# Altium project 4x tmc5160.PrjPcb (part 1 of 2)
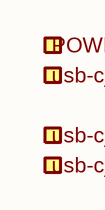
[diagram p0: charge-manager.SchDoc]
10 sheets, 219 parts. Net scope: hierarchical (ports join the sheet entries above them; power ports are global).
Board files: CM5IO.PcbDoc, CM5IO(1).PcbDoc, CM5IO_első terv.PcbDoc
Sheets:
  charge-manager.SchDoc
  CM5IO.SchDoc
    CM5_GPIO ( Ethernet, GPIO, SDCARD) = CM5_GPIO.SchDoc
    CM5_HighSpeed = CM5_HighSpeed.SchDoc
    PCIe-M2 = PCIe-M2.SchDoc
    PSUs = PSUs.SchDoc
    YD-ESP32-S3 = YD-ESP32-S3.SchDoc
      4x tmc5160 = 4x tmc5160.SchDoc
      adc = adc.SchDoc
    USB2-HUB = USB2-HUB.SchDoc

## Sheet charge-manager.SchDoc
size 297 x 209 mm

### Ports
POWER-OUT (in), usb-c_cc1 (in), usb-c_cc (in), usb-c_vbus (in)

### Notes on the sheet
- 1
- 2
- 3
- 4
- 5
- 6
- A
- B
- C
- D
- Title:
- File: charge-manager.kicad_sch
- Sheet: /
- KiCad E.D.A.  kicad (5.1.4)-1
- Size: A4
- Date:
- Rev:
- Id: 1/1

## Sheet CM5IO.SchDoc
size 1188 x 840 mm
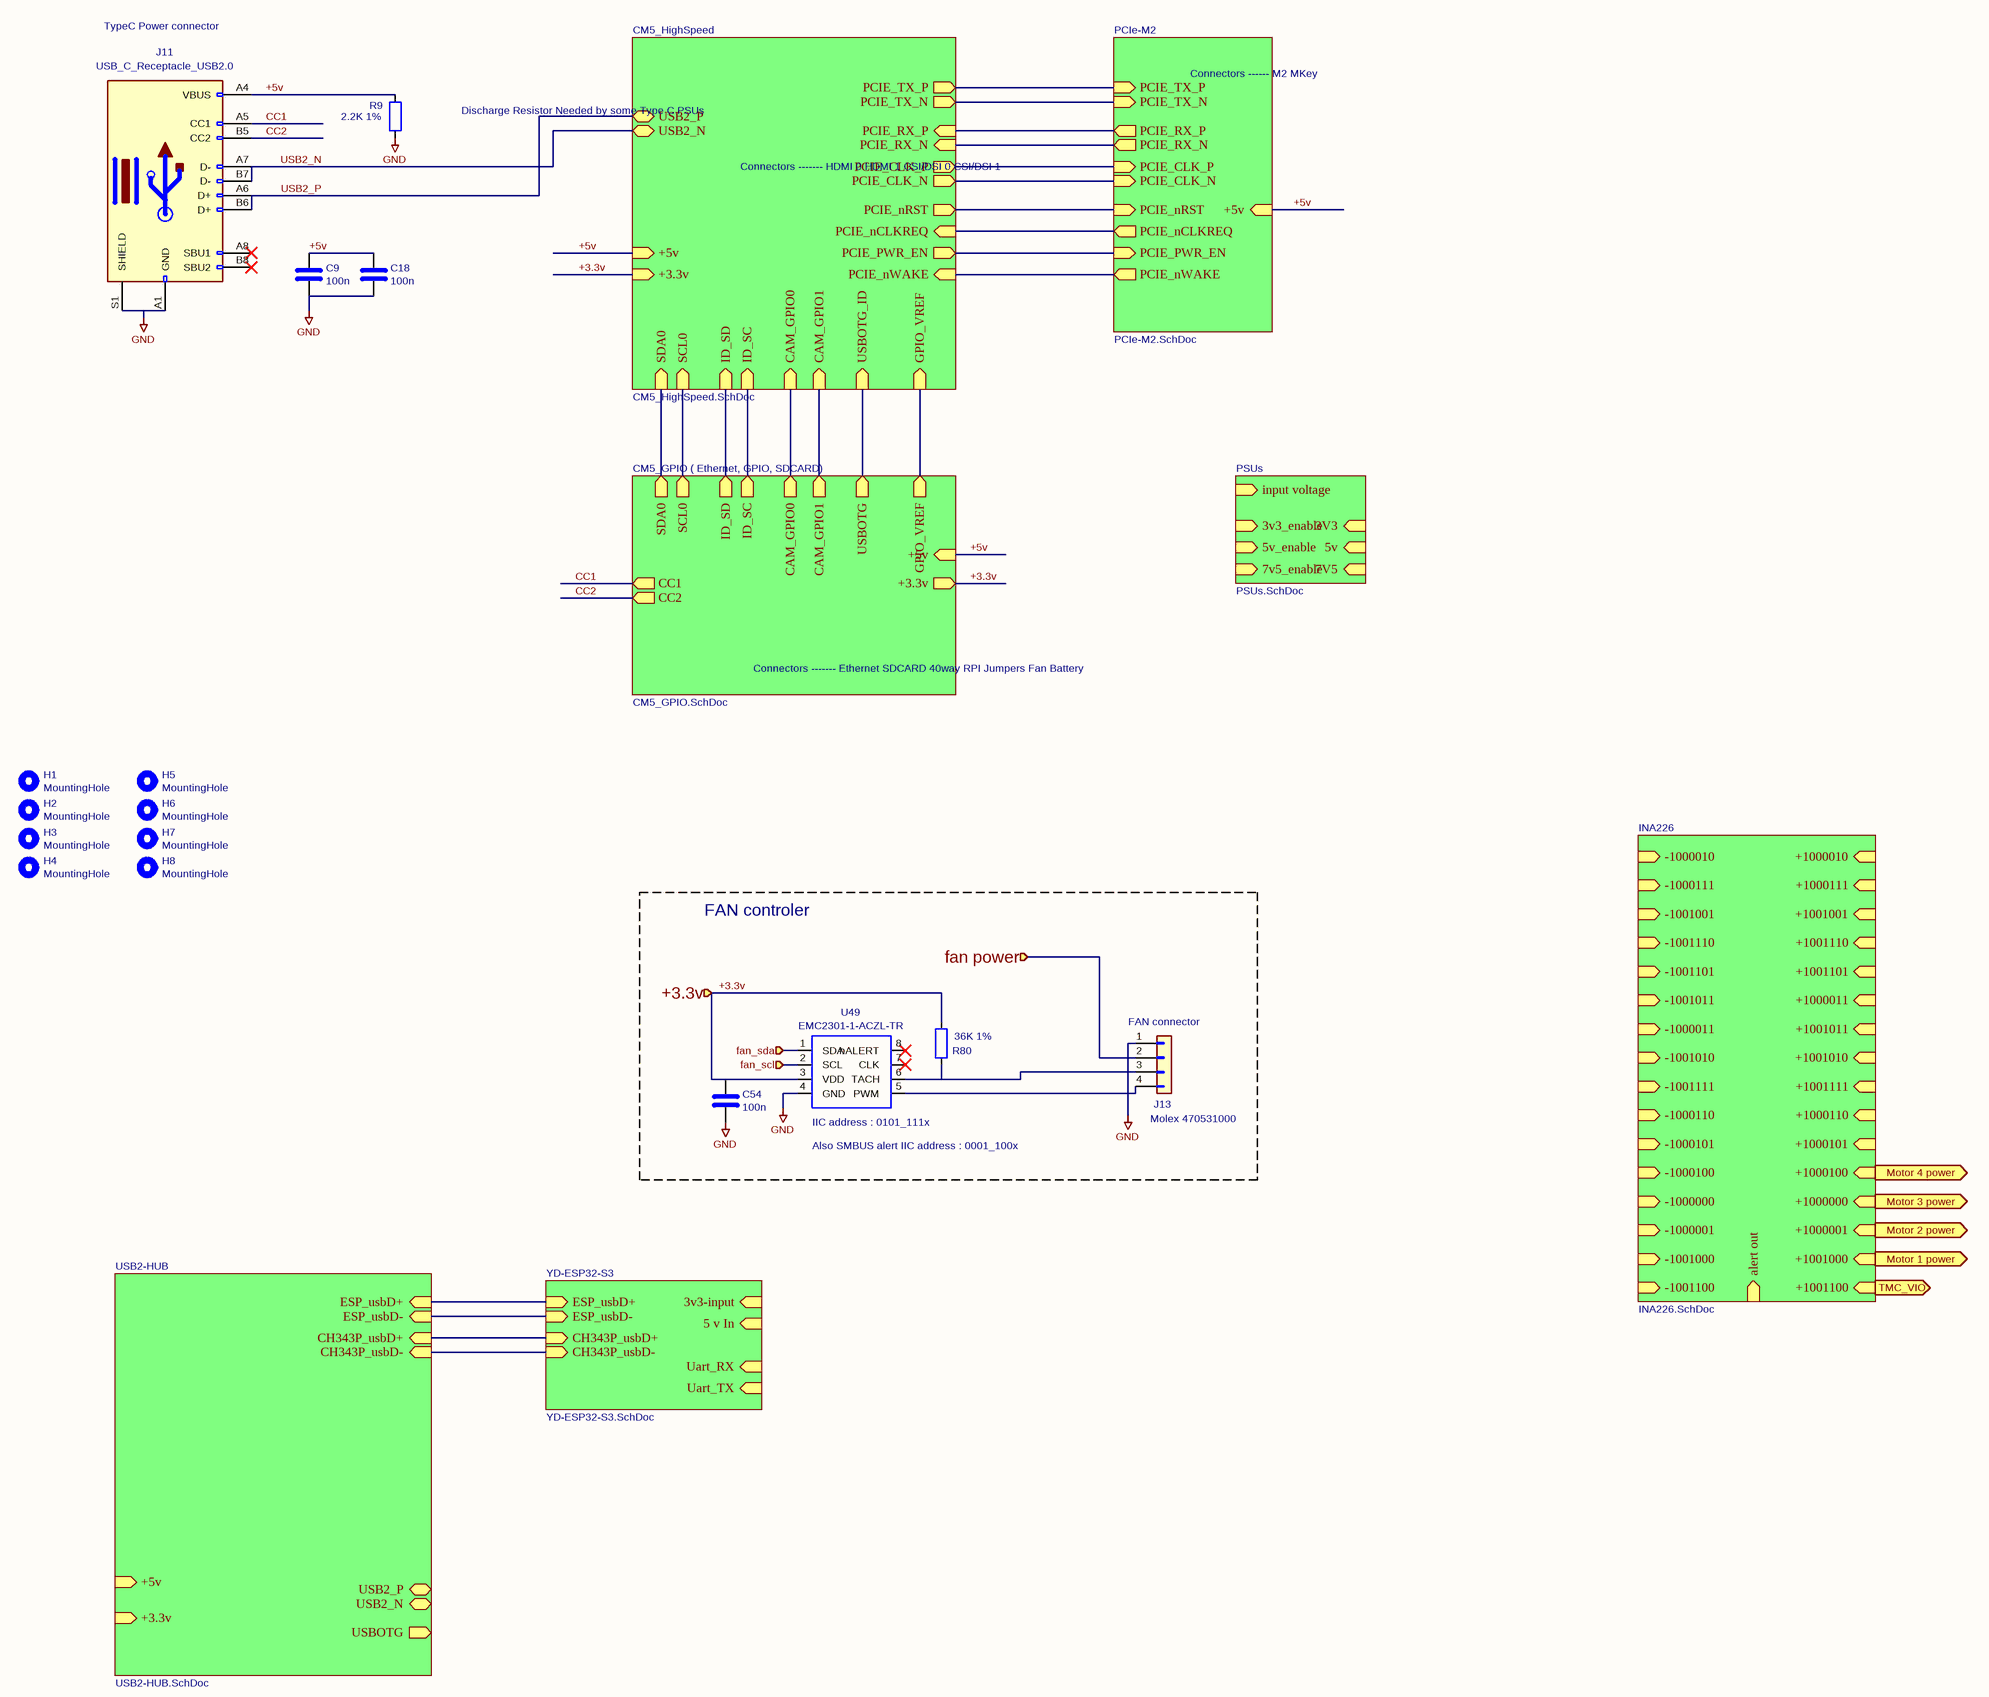
[diagram p1: CM5IO.SchDoc]

### Parts
C9  100n  [C_0402_1005Metric]
C18  100n  [C_0402_1005Metric]
C54  100n  [C_0805_2012Metric]
H1  MountingHole  [MountingHole_2.7mm_M2.5_DIN965]
H2  MountingHole  [MountingHole_2.7mm_M2.5_DIN965]
H3  MountingHole  [MountingHole_2.7mm_M2.5_DIN965]
H4  MountingHole  [MountingHole_2.7mm_M2.5_DIN965]
H5  MountingHole  [MountingHole_2.7mm_M2.5_DIN965]
H6  MountingHole  [MountingHole_2.7mm_M2.5_DIN965]
H7  MountingHole  [MountingHole_2.7mm_M2.5_DIN965]
H8  MountingHole  [MountingHole_2.7mm_M2.5_DIN965]
J11  USB_C_Receptacle_USB2.0  [USB_C_Receptacle_GCT_USB4105-xx-A_16P_TopMnt_Horizontal]
J13  Molex 470531000  [FanPinHeader_1x04_P2.54mm_Vertical]
R9  2.2K 1%  [R_0402_1005Metric]
R80  36K 1%  [R_0805_2012Metric_Pad1.20x1.40mm_HandSolder]
U49  EMC2301-1-ACZL-TR  [MSOP-8_3x3mm_P0.65mm]

### Blocks framed on the sheet
FAN controler: C54 J13 R80 U49

### Sub-sheets
CM5_GPIO ( Ethernet, GPIO, SDCARD) = CM5_GPIO.SchDoc: ID_SC (out), ID_SD (out), SCL0 (out), SDA0 (out), +5v (in), +3.3v (out), GPIO_VREF (out), CAM_GPIO0 (out), CAM_GPIO1 (out), CC1 (out), USBOTG (out), CC2 (out)
CM5_HighSpeed = CM5_HighSpeed.SchDoc: USB2_N (bidir), USB2_P (bidir), ID_SC (in), ID_SD (in), SCL0 (in), SDA0 (in), +5v (in), PCIE_CLK_P (out), PCIE_CLK_N (out), PCIE_TX_P (out), PCIE_TX_N (out), PCIE_nRST (out), PCIE_RX_P (in), PCIE_RX_N (in), PCIE_nCLKREQ (in), +3.3v (in), USBOTG_ID (in), GPIO_VREF (in), PCIE_PWR_EN (out), PCIE_nWAKE (in), CAM_GPIO0 (in), CAM_GPIO1 (in)
INA226 = INA226.SchDoc (file not in this document): -1000000 (in), +1000000 (in), alert out (in), -1000001 (in), +1000001 (in), -1001000 (in), +1001000 (in), -1001100 (in), +1001100 (in), -1000100 (in), +1000100 (in), -1000101 (in), +1000101 (in), -1001010 (in), +1001010 (in), -1001110 (in), -1001101 (in), +1001110 (in), -1001001 (in), +1001001 (in), -1000111 (in), +1000111 (in), -1001011 (in), +1001011 (in), -1001111 (in), +1001111 (in), +1001101 (in), -1000011 (in), +1000011 (in), -1000110 (in), +1000110 (in), -1000010 (in), +1000010 (in)
PCIe-M2 = PCIe-M2.SchDoc: PCIE_CLK_P (in), PCIE_CLK_N (in), PCIE_TX_P (in), PCIE_TX_N (in), PCIE_nCLKREQ (out), PCIE_nRST (in), PCIE_RX_P (out), PCIE_RX_N (out), +5v (in), PCIE_PWR_EN (in), PCIE_nWAKE (out)
PSUs = PSUs.SchDoc: 3v3_enable (in), input voltage (in), 5v (in), 5v_enable (in), 3V3 (in), 7v5_enable (in), 7V5 (in)
USB2-HUB = USB2-HUB.SchDoc: USB2_N (bidir), USB2_P (bidir), +5v (in), +3.3v (in), USBOTG (out), ESP_usbD+ (in), ESP_usbD- (in), CH343P_usbD+ (in), CH343P_usbD- (in)
YD-ESP32-S3 = YD-ESP32-S3.SchDoc: 3v3-input (in), ESP_usbD+ (in), ESP_usbD- (in), 5 v In (in), CH343P_usbD+ (in), CH343P_usbD- (in), Uart_RX (in), Uart_TX (in)

### Ports
+3.3v (in), fan power (in), fan_scl (in), fan_sda (in), Motor 1 power (in), Motor 2 power (in), Motor 3 power (in), Motor 4 power (in), TMC_VIO (in)

### Nets
GND: C9.2 C18.2 C54.2 J11.A1(GND) J11.S1(SHIELD) J13.1(Pin_1) R9.2 U49.4(GND)  [project net DPHY1_C_N]
+3.3v: C54.1 R80.2 U49.3(VDD) ; port +3.3v, sheet CM5_GPIO ( Ethernet, GPIO, SDCARD)/+3.3v, sheet CM5_HighSpeed/+3.3v
+5v: C9.1 C18.1 J11.A4(VBUS) R9.1 ; sheet CM5_GPIO ( Ethernet, GPIO, SDCARD)/+5v, sheet CM5_HighSpeed/+5v, sheet PCIe-M2/+5v
CAM_GPIO0: sheet CM5_GPIO ( Ethernet, GPIO, SDCARD)/CAM_GPIO0, sheet CM5_HighSpeed/CAM_GPIO0
CAM_GPIO1: sheet CM5_GPIO ( Ethernet, GPIO, SDCARD)/CAM_GPIO1, sheet CM5_HighSpeed/CAM_GPIO1
CC1: J11.A5(CC1) ; sheet CM5_GPIO ( Ethernet, GPIO, SDCARD)/CC1
CC2: J11.B5(CC2) ; sheet CM5_GPIO ( Ethernet, GPIO, SDCARD)/CC2
CH343P_usbD+: sheet YD-ESP32-S3/CH343P_usbD+, sheet USB2-HUB/CH343P_usbD+
CH343P_usbD-: sheet YD-ESP32-S3/CH343P_usbD-, sheet USB2-HUB/CH343P_usbD-
ESP_usbD+: sheet YD-ESP32-S3/ESP_usbD+, sheet USB2-HUB/ESP_usbD+
ESP_usbD-: sheet YD-ESP32-S3/ESP_usbD-, sheet USB2-HUB/ESP_usbD-
fan power: J13.2(Pin_2) ; port fan power
fan_scl: U49.2(SCL) ; port fan_scl
fan_sda: U49.1(SDA) ; port fan_sda
GPIO_VREF: sheet CM5_GPIO ( Ethernet, GPIO, SDCARD)/GPIO_VREF, sheet CM5_HighSpeed/GPIO_VREF
ID_SC: sheet CM5_GPIO ( Ethernet, GPIO, SDCARD)/ID_SC, sheet CM5_HighSpeed/ID_SC
ID_SD: sheet CM5_GPIO ( Ethernet, GPIO, SDCARD)/ID_SD, sheet CM5_HighSpeed/ID_SD
Motor 1 power: port Motor 1 power, sheet INA226/+1001000
Motor 2 power: port Motor 2 power, sheet INA226/+1000001
Motor 3 power: port Motor 3 power, sheet INA226/+1000000
Motor 4 power: port Motor 4 power, sheet INA226/+1000100
PCIE_CLK_N: sheet CM5_HighSpeed/PCIE_CLK_N, sheet PCIe-M2/PCIE_CLK_N
PCIE_CLK_P: sheet CM5_HighSpeed/PCIE_CLK_P, sheet PCIe-M2/PCIE_CLK_P
PCIE_nCLKREQ: sheet CM5_HighSpeed/PCIE_nCLKREQ, sheet PCIe-M2/PCIE_nCLKREQ
PCIE_nRST: sheet CM5_HighSpeed/PCIE_nRST, sheet PCIe-M2/PCIE_nRST
PCIE_nWAKE: sheet CM5_HighSpeed/PCIE_nWAKE, sheet PCIe-M2/PCIE_nWAKE
PCIE_PWR_EN: sheet CM5_HighSpeed/PCIE_PWR_EN, sheet PCIe-M2/PCIE_PWR_EN
PCIE_RX_N: sheet CM5_HighSpeed/PCIE_RX_N, sheet PCIe-M2/PCIE_RX_N
PCIE_RX_P: sheet CM5_HighSpeed/PCIE_RX_P, sheet PCIe-M2/PCIE_RX_P
PCIE_TX_N: sheet CM5_HighSpeed/PCIE_TX_N, sheet PCIe-M2/PCIE_TX_N
PCIE_TX_P: sheet CM5_HighSpeed/PCIE_TX_P, sheet PCIe-M2/PCIE_TX_P
SCL0: sheet CM5_GPIO ( Ethernet, GPIO, SDCARD)/SCL0, sheet CM5_HighSpeed/SCL0
SDA0: sheet CM5_GPIO ( Ethernet, GPIO, SDCARD)/SDA0, sheet CM5_HighSpeed/SDA0
TMC_VIO: port TMC_VIO, sheet INA226/+1001100
USB2_N: J11.A7(D-) J11.B7(D-) ; sheet CM5_HighSpeed/USB2_N
USB2_P: J11.A6(D+) J11.B6(D+) ; sheet CM5_HighSpeed/USB2_P
USBOTG: sheet CM5_GPIO ( Ethernet, GPIO, SDCARD)/USBOTG, sheet CM5_HighSpeed/USBOTG_ID
NetJ13_3: J13.3(Pin_3) R80.1 U49.6(TACH)
NetJ13_4: J13.4(Pin_4) U49.5(PWM)

Not connected (* = marked no-connect by the designer): J11 A8(SBU1)* A9(VBUS) A12(GND) B1(GND) B4(VBUS) B8(SBU2)* B9(VBUS) B12(GND); U49 7(CLK)* 8(nALERT)*

### Notes on the sheet
- TypeC Power connector
- Connectors
  ------
  M2 MKey
- Discharge Resistor
  Needed by some
  Type C PSUs
- Connectors
  -------
  HDMI 0
  HDMI 1
  CSI/DSI 0
  CSI/DSI 1
- Connectors
  -------
  Ethernet
  SDCARD
  40way RPI
  Jumpers
  Fan
  Battery
- (near J13) FAN connector
- (near U49) IIC address : 0101_111x
- (near U49) Also SMBUS alert IIC address : 0001_100x
- 1
- 2
- 3
- 4
- 5
- 6
- 7
- 8
- 9
- 10
- 11
- 12
- 13
- 14
- 15
- 16
- 17
- 18
- 19
- 20
- 21
- 22
- 23
- A
- B
- C
- D
- E
- F
- G
- H
- I
- J
- K
- L
- M
- N
- O
- P
- www.raspberrypi.com <http://www.raspberrypi.com>
- Title: Compute Module 5 IO Board - Top Level
- File: CM5IO.kicad_sch
- Sheet: /
- Copyright © 2024 Raspberry Pi Ltd.
- KiCad E.D.A.  kicad (5.1.4)-1
- Size: A0
- Date:
- Rev: 1
- Id: 1/1

### Library data of the parts
C9 C18 = C: Part Description: 0.1uF 10% 16V Ceramic Capacitor X7R 0402 (1005 Metric); Field4: Farnell; Field5: 2611911; Field6: RM EMK105 B7104KV-F; Field7: TAIYO YUDEN EUROPE GMBH; Field8: 110091611; Value: 100n; Footprint: Capacitor_SMD:C_0402_1005Metric
C54 = C: Part Description: 0.1uF 10% 16V Ceramic Capacitor X7R 0402 (1005 Metric); Description: Unpolarized capacitor; Field4: Farnell; Field5: 2611911; Field6: RM EMK105 B7104KV-F; Field7: TAIYO YUDEN EUROPE GMBH; Field8: 110091611; Value: 100n; Footprint: Capacitor_SMD:C_0805_2012Metric
H1-H8 = MountingHole: Part Description: M2.5 mounting hole; Field4: nf; Field5: nf; Field6: nf; Field7: nf; Value: MountingHole; Footprint: CM5IO:MountingHole_2.7mm_M2.5_DIN965
J11 = USB_C_Receptacle_USB2.0_16P: Part Description: USBC USB2 data and power connector; Field5: USBF31-0171; Field7: MTCONN; Field6: USBF31-0171; Value: USB_C_Receptacle_USB2.0; Footprint: Connector_USB:USB_C_Receptacle_GCT_USB4105-xx-A_16P_TopMnt_Horizontal
J13 = Conn_01x04: Part Description: Connector Header Through Hole 4 position 0.100" (2.54mm); Description: Generic connector, single row, 01x04, script generated (kicad-library-utils/schlib/autogen/connector/); Field4: Farnell; Field5: 2313705; Field6: 470531000; Field7: Molex; Value: Molex 470531000; Footprint: Connector:FanPinHeader_1x04_P2.54mm_Vertical
R9 = R: Part Description: Resistor 2.2K M1005 1% 63mW; Field4: Farnell; Value: 2.2K 1%; Footprint: Resistor_SMD:R_0402_1005Metric
R80 = R: Part Description: Resistor 36K M1005 1% 63mW; Description: Resistor; Field4: Farnell; Field5: 1458788; Field7: Rohm; Field6: MCR01MZPF3602; Value: 36K 1%; Footprint: Resistor_SMD:R_0805_2012Metric_Pad1.20x1.40mm_HandSolder
U49 = EMC2301: Part Description: Motor Driver PWM 8-MSOP; Field4: Digikey; Field5: EMC2301-1-ACZL-CT-ND; Field7: Microchip; Field6: EMC2301-1-ACZL-TR; Value: EMC2301-1-ACZL-TR; Footprint: Package_SO:MSOP-8_3x3mm_P0.65mm

## Sheet CM5_GPIO.SchDoc
size 297 x 209 mm
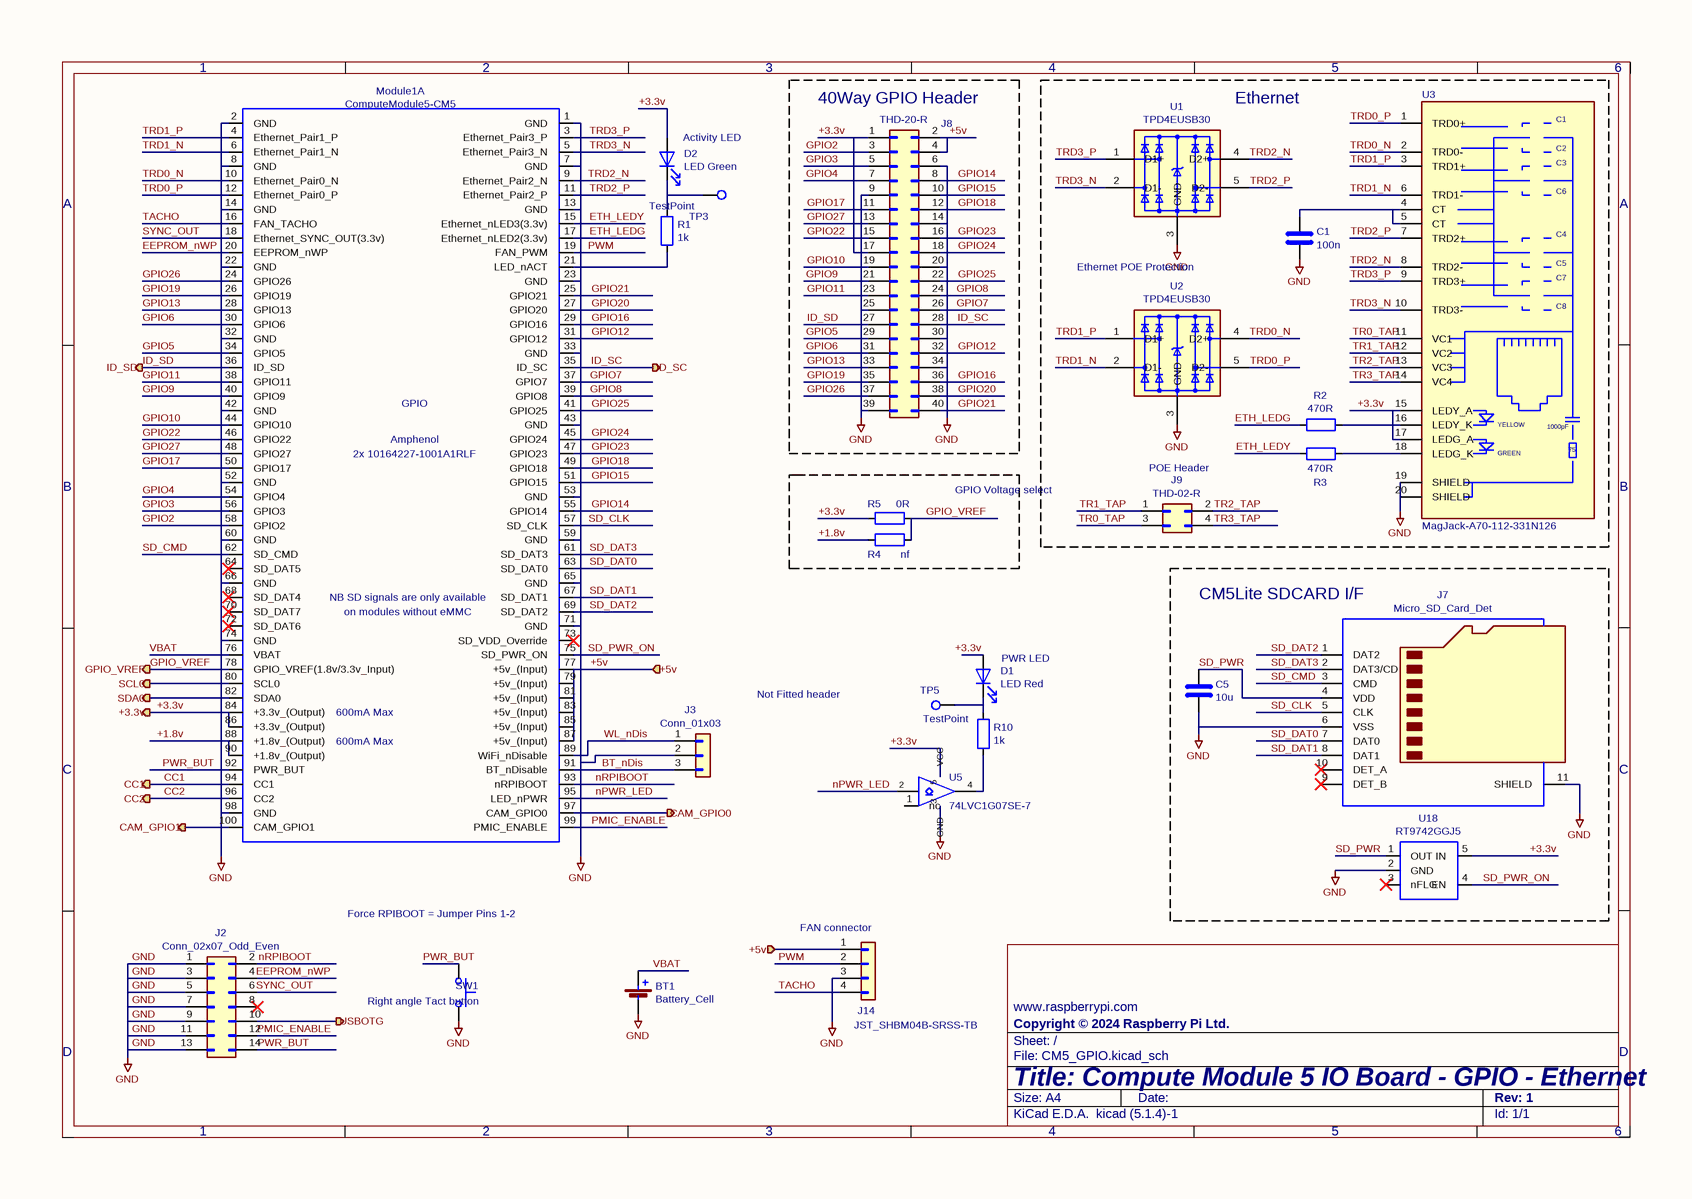
[diagram p2: CM5_GPIO.SchDoc]

### Parts
BT1  Battery_Cell  [BatteryHolder_Keystone_3034_1x20mm]
C1  100n  [C_0402_1005Metric]
C5  10u  [C_0805_2012Metric]
D1  LED Red  [LED_0603_1608Metric]
D2  LED Green  [LED_0603_1608Metric]
J2  Conn_02x07_Odd_Even  [PinHeader_2x07_P2.54mm_Vertical]
J3  Conn_01x03  [PinHeader_1x03_P2.54mm_Vertical]
J7  Micro_SD_Card_Det  [SDCARD_MOLEX_503398-1892]
J8  THD-20-R  [PinHeader_2x20_P2.54mm_Vertical]
J9  THD-02-R  [PinHeader_2x02_P2.54mm_Vertical]
J14  JST_SHBM04B-SRSS-TB  [JST_SH_BM04B-SRSS-TB_1x04-1MP_P1.00mm_Vertical]
Module1  Field4: Amphenol  Field5: 2x 10164227-1001A1RLF  [Raspberry-Pi-5-Compute-Module]  (hidden comment: ComputeModule5-CM5)  (part A of 2)
R1  1k  [R_0402_1005Metric]
R2  470R  [R_0402_1005Metric]
R3  470R  [R_0402_1005Metric]
R4  nf  [R_0805_2012Metric_Pad1.20x1.40mm_HandSolder]
R5  0R  [R_0805_2012Metric_Pad1.20x1.40mm_HandSolder]
R10  1k  [R_0402_1005Metric]
SW1  Right angle Tact button  [SW_Tactile_SPST_Angled_PTS645Vx58-2LFS]
TP3  TestPoint  [TestPoint_Pad_2.0x2.0mm]
TP5  TestPoint  [TestPoint_Pad_2.0x2.0mm]
U1  TPD4EUSB30  [USON-10_2.5x1.0mm_P0.5mm]
U2  TPD4EUSB30  [USON-10_2.5x1.0mm_P0.5mm]
U3  MagJack-A70-112-331N126  [TRJG0926HENL]
U5  74LVC1G07SE-7  [SOT-353_SC-70-5]
U18  RT9742GGJ5  [SOT-23-5]

### Blocks framed on the sheet
40Way GPIO Header: J8
Ethernet: C1 J9 R2 R3 U1-U3
GPIO Voltage select /: R4 R5
CM5Lite SDCARD I/F: C5 J7 U18

### Ports
+3.3v (out), +5v (in), CAM_GPIO0 (out), CAM_GPIO1 (out), CC1 (out), CC2 (out), GPIO_VREF (out), ID_SC (out), ID_SD (out), SCL0 (out), SDA0 (out), USBOTG (out)

### Nets
GND: BT1.2(-) C1.2 C5.2 J2.1(Pin_1) J2.3(Pin_3) J2.5(Pin_5) J2.7(Pin_7) J2.9(Pin_9) J2.11(Pin_11) J2.13(Pin_13) J3.2(Pin_2) J7.6(VSS) J7.11(SHIELD) J8.6(Pin_6) J8.9(Pin_9) J8.14(Pin_14) J8.20(Pin_20) J8.25(Pin_25) J8.30(Pin_30) J8.34(Pin_34) J8.39(Pin_39) J14.3(Pin_3) Module1.1(GND) Module1.2(GND) Module1.7(GND) Module1.8(GND) Module1.13(GND) Module1.14(GND) Module1.22(GND) Module1.23(GND) Module1.32(GND) Module1.33(GND) Module1.42(GND) Module1.43(GND) Module1.52(GND) Module1.53(GND) Module1.59(GND) Module1.60(GND) Module1.65(GND) Module1.66(GND) Module1.71(GND) Module1.74(GND) Module1.98(GND) SW1.2 U1.3(GND) U2.3(GND) U3.19(SHIELD) U3.20(SHIELD) U5.3(GND) U18.2(GND)  [project net DPHY1_C_N]
+1.8v: Module1.88(+1.8v_(Output)) Module1.90(+1.8v_(Output)) R4.1
+3.3v: D1.2(A) D2.2(A) J8.1(Pin_1) J8.17(Pin_17) Module1.84(+3.3v_(Output)) Module1.86(+3.3v_(Output)) R5.1 U3.15(LEDY_A) U3.17(LEDG_A) U5.5(VCC) U18.5(IN) ; port +3.3v
+5v: J8.2(Pin_2) J8.4(Pin_4) J14.1(Pin_1) Module1.77(+5v_(Input)) Module1.79(+5v_(Input)) Module1.81(+5v_(Input)) Module1.83(+5v_(Input)) Module1.85(+5v_(Input)) Module1.87(+5v_(Input)) ; port +5v
BT_nDis: J3.3(Pin_3) Module1.91(BT_nDisable)
CAM_GPIO0: Module1.97(CAM_GPIO0) ; port CAM_GPIO0
CAM_GPIO1: Module1.100(CAM_GPIO1) ; port CAM_GPIO1
CC1: Module1.94(CC1) ; port CC1
CC2: Module1.96(CC2) ; port CC2
EEPROM_nWP: J2.4(Pin_4) Module1.20(EEPROM_nWP)
ETH_LEDG: Module1.17(Ethernet_nLED2(3.3v)) R2.2
ETH_LEDY: Module1.15(Ethernet_nLED3(3.3v)) R3.2
GPIO2: J8.3(Pin_3) Module1.58(GPIO2)
GPIO3: J8.5(Pin_5) Module1.56(GPIO3)
GPIO4: J8.7(Pin_7) Module1.54(GPIO4)
GPIO5: J8.29(Pin_29) Module1.34(GPIO5)
GPIO6: J8.31(Pin_31) Module1.30(GPIO6)
GPIO7: J8.26(Pin_26) Module1.37(GPIO7)
GPIO8: J8.24(Pin_24) Module1.39(GPIO8)
GPIO9: J8.21(Pin_21) Module1.40(GPIO9)
GPIO10: J8.19(Pin_19) Module1.44(GPIO10)
GPIO11: J8.23(Pin_23) Module1.38(GPIO11)
GPIO12: J8.32(Pin_32) Module1.31(GPIO12)
GPIO13: J8.33(Pin_33) Module1.28(GPIO13)
GPIO14: J8.8(Pin_8) Module1.55(GPIO14)
GPIO15: J8.10(Pin_10) Module1.51(GPIO15)
GPIO16: J8.36(Pin_36) Module1.29(GPIO16)
GPIO17: J8.11(Pin_11) Module1.50(GPIO17)
GPIO18: J8.12(Pin_12) Module1.49(GPIO18)
GPIO19: J8.35(Pin_35) Module1.26(GPIO19)
GPIO20: J8.38(Pin_38) Module1.27(GPIO20)
GPIO21: J8.40(Pin_40) Module1.25(GPIO21)
GPIO22: J8.15(Pin_15) Module1.46(GPIO22)
GPIO23: J8.16(Pin_16) Module1.47(GPIO23)
GPIO24: J8.18(Pin_18) Module1.45(GPIO24)
GPIO25: J8.22(Pin_22) Module1.41(GPIO25)
GPIO26: J8.37(Pin_37) Module1.24(GPIO26)
GPIO27: J8.13(Pin_13) Module1.48(GPIO27)
GPIO_VREF: Module1.78(GPIO_VREF(1.8v/3.3v_Input)) R4.2 R5.2 ; port GPIO_VREF
ID_SC: J8.28(Pin_28) Module1.35(ID_SC) ; port ID_SC
ID_SD: J8.27(Pin_27) Module1.36(ID_SD) ; port ID_SD
nPWR_LED: Module1.95(LED_nPWR) U5.2
nRPIBOOT: J2.2(Pin_2) Module1.93(nRPIBOOT)
PMIC_ENABLE: J2.12(Pin_12) Module1.99(PMIC_ENABLE)
PWM: J14.2(Pin_2) Module1.19(FAN_PWM)
PWR_BUT: J2.14(Pin_14) Module1.92(PWR_BUT) SW1.1
SCL0: Module1.80(SCL0) ; port SCL0
SD_CLK: J7.5(CLK) Module1.57(SD_CLK)
SD_CMD: J7.3(CMD) Module1.62(SD_CMD)
SD_DAT0: J7.7(DAT0) Module1.63(SD_DAT0)
SD_DAT1: J7.8(DAT1) Module1.67(SD_DAT1)
SD_DAT2: J7.1(DAT2) Module1.69(SD_DAT2)
SD_DAT3: J7.2(DAT3/CD) Module1.61(SD_DAT3)
SD_PWR: C5.1 J7.4(VDD) U18.1(OUT)
SD_PWR_ON: Module1.75(SD_PWR_ON) U18.4(EN)
SDA0: Module1.82(SDA0) ; port SDA0
SYNC_OUT: J2.6(Pin_6) Module1.18(Ethernet_SYNC_OUT(3.3v))
TACHO: J14.4(Pin_4) Module1.16(FAN_TACHO)
TR0_TAP: J9.3(Pin_3) U3.11(VC1)
TR1_TAP: J9.1(Pin_1) U3.12(VC2)
TR2_TAP: J9.2(Pin_2) U3.13(VC3)
TR3_TAP: J9.4(Pin_4) U3.14(VC4)
TRD0_N: Module1.10(Ethernet_Pair0_N) U2.4(D2+) U3.2(TRD0-)
TRD0_P: Module1.12(Ethernet_Pair0_P) U2.5(D2-) U3.1(TRD0+)
TRD1_N: Module1.6(Ethernet_Pair1_N) U2.2(D1-) U3.6(TRD1-)
TRD1_P: Module1.4(Ethernet_Pair1_P) U2.1(D1+) U3.3(TRD1+)
TRD2_N: Module1.9(Ethernet_Pair2_N) U1.4(D2+) U3.8(TRD2-)
TRD2_P: Module1.11(Ethernet_Pair2_P) U1.5(D2-) U3.7(TRD2+)
TRD3_N: Module1.5(Ethernet_Pair3_N) U1.2(D1-) U3.10(TRD3-)
TRD3_P: Module1.3(Ethernet_Pair3_P) U1.1(D1+) U3.9(TRD3+)
USBOTG: J2.10(Pin_10) ; port USBOTG
VBAT: BT1.1(+) Module1.76(VBAT)
WL_nDis: J3.1(Pin_1) Module1.89(WiFi_nDisable)
NetC1_1: C1.1 U3.4(CT) U3.5(CT)
NetD1_1: D1.1(K) R10.1 TP5.1
NetD2_1: D2.1(K) R1.1 TP3.1
NetModule1_21: Module1.21(LED_nACT) R1.2
NetR2_1: R2.1 U3.16(LEDY_K)
NetR3_1: R3.1 U3.18(LEDG_K)
NetR10_2: R10.2 U5.4

Not connected (* = marked no-connect by the designer): J2 8(Pin_8)*; J7 9(DET_B)* 10(DET_A)*; Module1 64(SD_DAT5)* 68(SD_DAT4)* 70(SD_DAT7)* 72(SD_DAT6)* 73(SD_VDD_Override)*; U1 6 7 8(GND) 9 10; U2 6 7 8(GND) 9 10; U5 1(nc); U18 3(nFLG)*

### Notes on the sheet
- (near D2) Activity LED
- Ethernet POE
  Protection
- (near J9) POE Header
- Not Fitted header
- (near D1) PWR LED
- Force RPIBOOT = Jumper Pins 1-2
- (near J14) FAN connector
- 1
- 2
- 3
- 4
- 5
- 6
- A
- B
- C
- www.raspberrypi.com <http://www.raspberrypi.com>
- D
- Title: Compute Module 5 IO Board - GPIO - Ethernet
- File: CM5_GPIO.kicad_sch
- Sheet: /
- Copyright © 2024 Raspberry Pi Ltd.
- KiCad E.D.A.  kicad (5.1.4)-1
- Size: A4
- Date:
- Rev: 1
- Id: 1/1
- (in symbol ComputeModule5-CM5, part A) GPIO; NB SD signals are only available; on modules without eMMC; 600mA Max
- (in symbol MagJack-A70-112-331N126) C1; C2; C3; C6; C4; C5; C7; C8; YELLOW; 1000pF; 75; GREEN

### Library data of the parts
BT1 = Battery_Cell: Part Description: Battery Retainer Coin, 20.0mm 1 Cell SMD (SMT) Tab; Field4: Digikey; Field5: 36-3034-ND; Field6: 3034; Field7: Keystone; Value: Battery_Cell; Footprint: CM5IO:BatteryHolder_Keystone_3034_1x20mm
C1 = C: as C9 on sheet CM5IO; Value: 100n; Footprint: Capacitor_SMD:C_0402_1005Metric
C5 = C: Part Description: 10uF 10% 10V Ceramic Capacitor X7R 0805 (2012 Metric); Field5: 490-14381-1-ND; Field4: Digikey; Field6: GRM21BR71A106KA73L; Field7: Murata; Field8: 111893011; Value: 10u; Footprint: Capacitor_SMD:C_0805_2012Metric
D1 = LED_1: Part Description: Red 620nm LED Indication - Discrete 2.2V 2-SMD, No Lead; Field4: Digikey; Field5: LTST-S270KRKT; Field6: SML-A12U8TT86Q; Field7: Rohm; Field8: 650295101; Value: LED Red; Footprint: LED_SMD:LED_0603_1608Metric
D2 = LED: Part Description: Green 572nm LED Indication - Discrete 2.2V 2-SMD, No Lead; Field4: Digikey; Field5: LTST-S270KGKT; Field6: SML-A12M8TT86N; Field7: Rohm; Field8: 650263301; Value: LED Green; Footprint: LED_SMD:LED_0603_1608Metric
J2 = Conn_02x07_Odd_Even: Field4: Toby; Field5: THD-07-R; Field6: THD-07-R; Field7: Toby; Part Description: PinHeader_2x07_P2.54mm_Vertical; Value: Conn_02x07_Odd_Even; Footprint: Connector_PinHeader_2.54mm:PinHeader_2x07_P2.54mm_Vertical
J3 = Conn_01x03: Part Description: 3pin 0.1" connector; Field4: nf; Field5: nf; Field6: nf; Field7: nf; Value: Conn_01x03; Footprint: Connector_PinHeader_2.54mm:PinHeader_1x03_P2.54mm_Vertical
J7 = Micro_SD_Card_Det2: Part Description: 9 (8 + 1) Position Card Connector microSD™ Surface Mount, Right Angle Gold; Field4: Farnell; Field5: 2358234; Field6: 503398-1892; Field7: Molex; Field8: UCON00512; Value: Micro_SD_Card_Det; Footprint: CM5IO:SDCARD_MOLEX_503398-1892
J8 = Conn_02x20_Odd_Even: Field4: Toby; Field8: UCON00511; Field5: THD-20-R; Field6: THD-20-R; Field7: Toby; Part Description: PinHeader_2x20_P2.54mm_Vertical; Value: THD-20-R; Footprint: Connector_PinHeader_2.54mm:PinHeader_2x20_P2.54mm_Vertical
J9 = Conn_02x02_Odd_Even: Field4: Toby; Field6: 151-604-425-761; Field7: EDAC; Field8: UCON00791; Field5: THD-02-R; Part Description: PinHeader_2x02_P2.54mm_Vertical; Value: THD-02-R; Footprint: Connector_PinHeader_2.54mm:PinHeader_2x02_P2.54mm_Vertical
J14 = Conn_01x04: Part Description: 4 pin vertical 1mm pitch connector; Field7: JST; Field5: SHBM04B-SRSS-TB; Field6: SHBM04B-SRSS-TB; Value: JST_SHBM04B-SRSS-TB; Footprint: Connector_JST:JST_SH_BM04B-SRSS-TB_1x04-1MP_P1.00mm_Vertical
Module1 = ComputeModule5-CM5: Part Description: 100 Position Connector Receptacle, Center Strip Contacts Surface Mount Gold; Description: RaspberryPi Compute module 5; Field7: Hirose; Field6: 2x 10164227-1001A1RLF; Value: ComputeModule5-CM5; Footprint: CM5IO:Raspberry-Pi-5-Compute-Module
R1 R10 = R: Part Description: Resistor 1K M1005 1% 63mW; Field4: Farnell; Field5: 9239235; Field7: KOA EUROPE GMBH; Field6: RK73H1ETTP1001F; Field8: 125049511; Value: 1k; Footprint: Resistor_SMD:R_0402_1005Metric
R2 R3 = R: Part Description: Resistor 470R M1005 1% 63mW; Field4: Farnell; Field5: 9239197; Field7: KOA EUROPE GMBH; Field6: RK73G1ETQTP4700D; Field8: 120887981; Value: 470R; Footprint: Resistor_SMD:R_0402_1005Metric
R4 = R: Field4: nf; Field5: nf; Field6: nf; Value: nf; Footprint: Resistor_SMD:R_0805_2012Metric_Pad1.20x1.40mm_HandSolder
R5 = R: Part Description: Resistor 0R M2012 5%; Field4: Farnell; Field5: 9233750; Field7: Rohm; Field6: MCR10EZPJ000; Field8: 121629591; Value: 0R; Footprint: Resistor_SMD:R_0805_2012Metric_Pad1.20x1.40mm_HandSolder
SW1 = SW_Push: Part Description: Right angle through hole Tact switch; Description: Push button switch, generic, two pins; Field5: PTS645VH58-2LFS; Field7: CK; Field6: PTS645VH58-2LFS; Value: Right angle Tact button; Footprint: Button_Switch_THT:SW_Tactile_SPST_Angled_PTS645Vx58-2LFS
TP3 TP5 = TestPoint: Field4: nf; Field5: nf; Field6: nf; Field7: nf; Part Description: Test point; Value: TestPoint; Footprint: TestPoint:TestPoint_Pad_2.0x2.0mm
U1 U2 = TPD4EUSB30: Part Description: Quad TVS diode for high speed signals (USB3, GigE etc.); Field4: Farnell; Field5: 2335455; Field6: CDDFN10-3324P-13; Field7: Bourns; Field8: UDIO00346; Value: TPD4EUSB30; Footprint: Package_SON:USON-10_2.5x1.0mm_P0.5mm
U3 = MagJack-A70-112-331N126: Part Description: Gigabit Ethernet Magjack; Field7: Trxcon; Field8: UCON00900; Field6: TRJG0926HENL; Field5: TRJG0926HENL; Value: MagJack-A70-112-331N126; Footprint: CM5IO:TRJG0926HENL
U5 = 74LVC1G07_copy: Part Description: Buffer, Non-Inverting 1 Element 1 Bit per Element Open Drain Output SOT-353; Field4: Farnell; Field5: 2425492; Field7: Diodes; Field6: 74LVC1G07SE-7; Value: 74LVC1G07SE-7; Footprint: Package_TO_SOT_SMD:SOT-353_SC-70-5
U18 = RT9742GGJ5: Part Description: Power Switch/Driver 1:1 N-Channel 1A TSOT-23-5; Field4: Farnell; Field5: 2545875; Field7: RichTek; Field8: USWI00166; Field6: RT9742GGJ5; Value: RT9742GGJ5; Footprint: Package_TO_SOT_SMD:SOT-23-5

## Sheet CM5_HighSpeed.SchDoc
size 297 x 209 mm
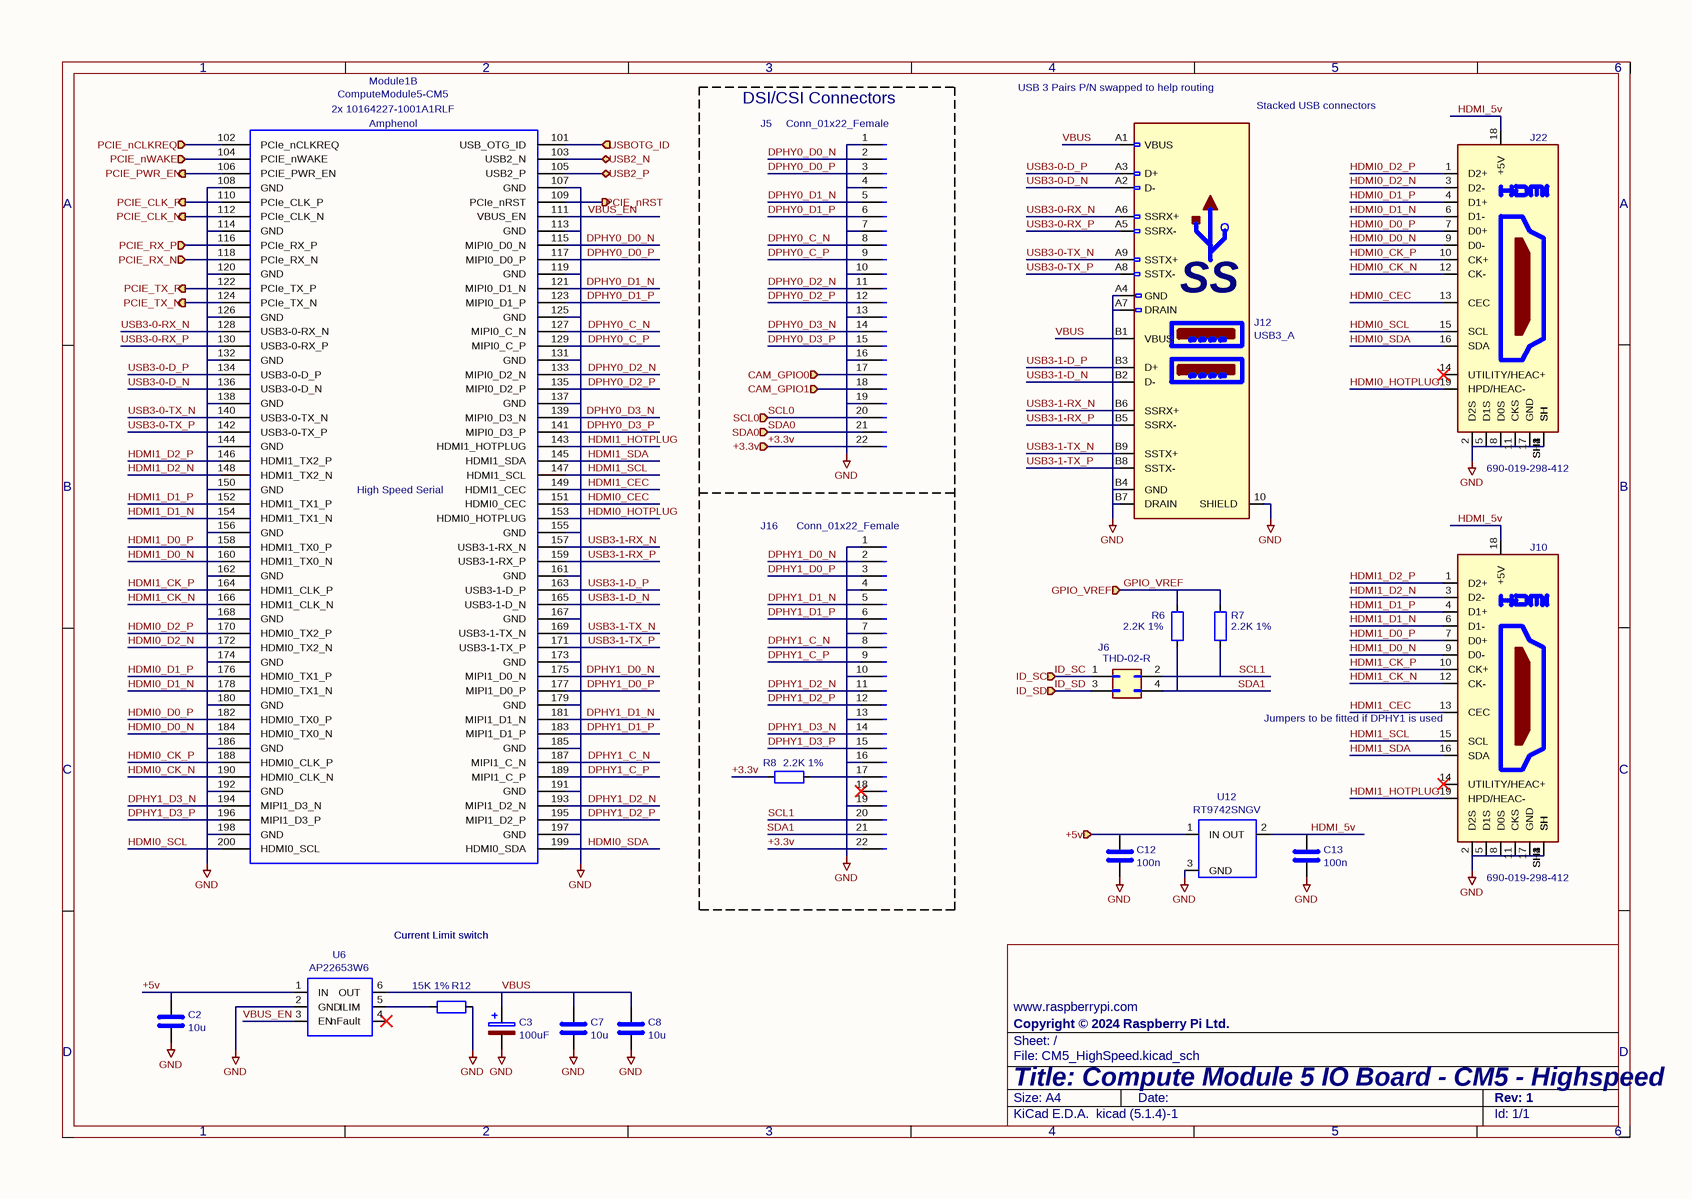
[diagram p3: CM5_HighSpeed.SchDoc]

### Parts
C2  10u  [C_0805_2012Metric]
C3  100uF  [CP_EIA-7343-31_Kemet-D]
C7  10u  [C_0805_2012Metric]
C8  10u  [C_0805_2012Metric]
C12  100n  [C_0402_1005Metric]
C13  100n  [C_0402_1005Metric]
J5  Conn_01x22_Female  [Hirose_FH12-22S-0.5SH_1x22-1MP_P0.50mm_Horizontal]
J6  THD-02-R  [PinHeader_2x02_P2.54mm_Vertical]
J10  690-019-298-412  [EDAC 690-019-298-412]
J12  USB3_A  [MTCONN_UBAF30-D2011]
J16  Conn_01x22_Female  [Hirose_FH12-22S-0.5SH_1x22-1MP_P0.50mm_Horizontal]
J22  690-019-298-412  [EDAC 690-019-298-412]
Module1  Field4: Amphenol  Field5: 2x 10164227-1001A1RLF  [Raspberry-Pi-5-Compute-Module]  (hidden comment: ComputeModule5-CM5)  (part B of 2)
R6  2.2K 1%  [R_0402_1005Metric]
R7  2.2K 1%  [R_0402_1005Metric]
R8  2.2K 1%  [R_0402_1005Metric]
R12  15K 1%  [R_0402_1005Metric]
U6  AP22653W6  [SOT-23-6]
U12  RT9742SNGV  [TSOT-23_HandSoldering]

### Ports
+3.3v (in), +5v (in), CAM_GPIO0 (in), CAM_GPIO1 (in), GPIO_VREF (in), ID_SC (in), ID_SD (in), PCIE_CLK_N (out), PCIE_CLK_P (out), PCIE_nCLKREQ (in), PCIE_nRST (out), PCIE_nWAKE (in), PCIE_PWR_EN (out), PCIE_RX_N (in), PCIE_RX_P (in), PCIE_TX_N (out), PCIE_TX_P (out), SCL0 (in), SDA0 (in), USB2_N (bidir), USB2_P (bidir), USBOTG_ID (in)

### Nets
DPHY1_C_N: C2.2 C3.2 C7.2 C8.2 C12.2 C13.2 J5.1(Pin_1) J5.4(Pin_4) J5.7(Pin_7) J5.10(Pin_10) J5.13(Pin_13) J5.16(Pin_16) J5.19(Pin_19) J10.2(D2S) J10.5(D1S) J10.8(D0S) J10.11(CKS) J10.17(GND) J10.SH1(SH) J10.SH2(SH) J10.SH3(SH) J10.SH4(SH) J12.10(SHIELD) J12.A4(GND) J12.A7(DRAIN) J12.B4(GND) J12.B7(DRAIN) J16.1(Pin_1) J16.4(Pin_4) J16.7(Pin_7) J16.8(Pin_8) J16.10(Pin_10) J16.13(Pin_13) J16.16(Pin_16) J16.19(Pin_19) J22.2(D2S) J22.5(D1S) J22.8(D0S) J22.11(CKS) J22.17(GND) J22.SH1(SH) J22.SH2(SH) J22.SH3(SH) J22.SH4(SH) Module1.107(GND) Module1.108(GND) Module1.113(GND) Module1.114(GND) Module1.119(GND) Module1.120(GND) Module1.125(GND) Module1.126(GND) Module1.131(GND) Module1.132(GND) Module1.137(GND) Module1.138(GND) Module1.144(GND) Module1.150(GND) Module1.155(GND) Module1.156(GND) Module1.161(GND) Module1.162(GND) Module1.167(GND) Module1.168(GND) Module1.173(GND) Module1.174(GND) Module1.179(GND) Module1.180(GND) Module1.185(GND) Module1.186(GND) Module1.187(MIPI1_C_N) Module1.191(GND) Module1.192(GND) Module1.197(GND) Module1.198(GND) R12.2 U6.2(GND) U12.3(GND)  [also labelled GND]
+3.3v: J5.22(Pin_22) J16.22(Pin_22) R8.1 ; port +3.3v
+5v: C12.1 U12.1(IN) ; port +5v
+5v: C2.1 U6.1(IN)  [a separate net that carries the same name]
CAM_GPIO0: J5.17(Pin_17) ; port CAM_GPIO0
CAM_GPIO1: J5.18(Pin_18) ; port CAM_GPIO1
DPHY0_C_N: J5.8(Pin_8) Module1.127(MIPI0_C_N)
DPHY0_C_P: J5.9(Pin_9) Module1.129(MIPI0_C_P)
DPHY0_D0_N: J5.2(Pin_2) Module1.115(MIPI0_D0_N)
DPHY0_D0_P: J5.3(Pin_3) Module1.117(MIPI0_D0_P)
DPHY0_D1_N: J5.5(Pin_5) Module1.121(MIPI0_D1_N)
DPHY0_D1_P: J5.6(Pin_6) Module1.123(MIPI0_D1_P)
DPHY0_D2_N: J5.11(Pin_11) Module1.133(MIPI0_D2_N)
DPHY0_D2_P: J5.12(Pin_12) Module1.135(MIPI0_D2_P)
DPHY0_D3_N: J5.14(Pin_14) Module1.139(MIPI0_D3_N)
DPHY0_D3_P: J5.15(Pin_15) Module1.141(MIPI0_D3_P)
DPHY1_C_P: J16.9(Pin_9) Module1.189(MIPI1_C_P)
DPHY1_D0_N: J16.2(Pin_2) Module1.175(MIPI1_D0_N)
DPHY1_D0_P: J16.3(Pin_3) Module1.177(MIPI1_D0_P)
DPHY1_D1_N: J16.5(Pin_5) Module1.181(MIPI1_D1_N)
DPHY1_D1_P: J16.6(Pin_6) Module1.183(MIPI1_D1_P)
DPHY1_D2_N: J16.11(Pin_11) Module1.193(MIPI1_D2_N)
DPHY1_D2_P: J16.12(Pin_12) Module1.195(MIPI1_D2_P)
DPHY1_D3_N: J16.14(Pin_14) Module1.194(MIPI1_D3_N)
DPHY1_D3_P: J16.15(Pin_15) Module1.196(MIPI1_D3_P)
GPIO_VREF: R6.1 R7.1 ; port GPIO_VREF
HDMI0_CEC: J22.13(CEC) Module1.151(HDMI0_CEC)
HDMI0_CK_N: J22.12(CK-) Module1.190(HDMI0_CLK_N)
HDMI0_CK_P: J22.10(CK+) Module1.188(HDMI0_CLK_P)
HDMI0_D0_N: J22.9(D0-) Module1.184(HDMI0_TX0_N)
HDMI0_D0_P: J22.7(D0+) Module1.182(HDMI0_TX0_P)
HDMI0_D1_N: J22.6(D1-) Module1.178(HDMI0_TX1_N)
HDMI0_D1_P: J22.4(D1+) Module1.176(HDMI0_TX1_P)
HDMI0_D2_N: J22.3(D2-) Module1.172(HDMI0_TX2_N)
HDMI0_D2_P: J22.1(D2+) Module1.170(HDMI0_TX2_P)
HDMI0_HOTPLUG: J22.19(HPD/HEAC-) Module1.153(HDMI0_HOTPLUG)
HDMI0_SCL: J22.15(SCL) Module1.200(HDMI0_SCL)
HDMI0_SDA: J22.16(SDA) Module1.199(HDMI0_SDA)
HDMI1_CEC: J10.13(CEC) Module1.149(HDMI1_CEC)
HDMI1_CK_N: J10.12(CK-) Module1.166(HDMI1_CLK_N)
HDMI1_CK_P: J10.10(CK+) Module1.164(HDMI1_CLK_P)
HDMI1_D0_N: J10.9(D0-) Module1.160(HDMI1_TX0_N)
HDMI1_D0_P: J10.7(D0+) Module1.158(HDMI1_TX0_P)
HDMI1_D1_N: J10.6(D1-) Module1.154(HDMI1_TX1_N)
HDMI1_D1_P: J10.4(D1+) Module1.152(HDMI1_TX1_P)
HDMI1_D2_N: J10.3(D2-) Module1.148(HDMI1_TX2_N)
HDMI1_D2_P: J10.1(D2+) Module1.146(HDMI1_TX2_P)
HDMI1_HOTPLUG: J10.19(HPD/HEAC-) Module1.143(HDMI1_HOTPLUG)
HDMI1_SCL: J10.15(SCL) Module1.147(HDMI1_SCL)
HDMI1_SDA: J10.16(SDA) Module1.145(HDMI1_SDA)
HDMI_5v: C13.1 J10.18(+5V) J22.18(+5V) U12.2(OUT)
ID_SC: J6.1(Pin_1) ; port ID_SC
ID_SD: J6.3(Pin_3) ; port ID_SD
PCIE_CLK_N: Module1.112(PCIe_CLK_N) ; port PCIE_CLK_N
PCIE_CLK_P: Module1.110(PCIe_CLK_P) ; port PCIE_CLK_P
PCIE_nCLKREQ: Module1.102(PCIe_nCLKREQ) ; port PCIE_nCLKREQ
PCIE_nRST: Module1.109(PCIe_nRST) ; port PCIE_nRST
PCIE_nWAKE: Module1.104(PCIE_nWAKE) ; port PCIE_nWAKE
PCIE_PWR_EN: Module1.106(PCIE_PWR_EN) ; port PCIE_PWR_EN
PCIE_RX_N: Module1.118(PCIe_RX_N) ; port PCIE_RX_N
PCIE_RX_P: Module1.116(PCIe_RX_P) ; port PCIE_RX_P
PCIE_TX_N: Module1.124(PCIe_TX_N) ; port PCIE_TX_N
PCIE_TX_P: Module1.122(PCIe_TX_P) ; port PCIE_TX_P
SCL0: J5.20(Pin_20) ; port SCL0
SCL1: J6.2(Pin_2) J16.20(Pin_20) R7.2
SDA0: J5.21(Pin_21) ; port SDA0
SDA1: J6.4(Pin_4) J16.21(Pin_21) R6.2
USB2_N: Module1.103(USB2_N) ; port USB2_N
USB2_P: Module1.105(USB2_P) ; port USB2_P
USB3-0-D_N: J12.A2(D-) Module1.136(USB3-0-D_N)
USB3-0-D_P: J12.A3(D+) Module1.134(USB3-0-D_P)
USB3-0-RX_N: J12.A6(SSRX+) Module1.128(USB3-0-RX_N)
USB3-0-RX_P: J12.A5(SSRX-) Module1.130(USB3-0-RX_P)
USB3-0-TX_N: J12.A9(SSTX+) Module1.140(USB3-0-TX_N)
USB3-0-TX_P: J12.A8(SSTX-) Module1.142(USB3-0-TX_P)
USB3-1-D_N: J12.B2(D-) Module1.165(USB3-1-D_N)
USB3-1-D_P: J12.B3(D+) Module1.163(USB3-1-D_P)
USB3-1-RX_N: J12.B6(SSRX+) Module1.157(USB3-1-RX_N)
USB3-1-RX_P: J12.B5(SSRX-) Module1.159(USB3-1-RX_P)
USB3-1-TX_N: J12.B9(SSTX+) Module1.169(USB3-1-TX_N)
USB3-1-TX_P: J12.B8(SSTX-) Module1.171(USB3-1-TX_P)
USBOTG: Module1.101(USB_OTG_ID) ; port USBOTG_ID
VBUS: C3.1 C7.1 C8.1 J12.A1(VBUS) J12.B1(VBUS) U6.6(OUT)
VBUS_EN: Module1.111(VBUS_EN) U6.3(EN)
NetJ16_17: J16.17(Pin_17) R8.2
NetR12_1: R12.1 U6.5(ILIM)

Not connected (* = marked no-connect by the designer): J10 14(UTILITY/HEAC+)*; J16 18(Pin_18)*; J22 14(UTILITY/HEAC+)*; U6 4(nFault)*

### Notes on the sheet
- (near J5) DSI/CSI Connectors
- (near J12) USB 3 Pairs P/N swapped to help routing
- (near J12) Stacked USB connectors
- (near J10) Jumpers to be fitted if DPHY1 is used
- Current Limit switch
- 1
- 2
- 3
- 4
- 5
- 6
- A
- B
- C
- www.raspberrypi.com <http://www.raspberrypi.com>
- D
- Title: Compute Module 5 IO Board - CM5 - Highspeed
- File: CM5_HighSpeed.kicad_sch
- Sheet: /
- Copyright © 2024 Raspberry Pi Ltd.
- KiCad E.D.A.  kicad (5.1.4)-1
- Size: A4
- Date:
- Rev: 1
- Id: 1/1
- (in symbol ComputeModule5-CM5, part B) High Speed Serial
- (in symbol USB3_A) SS

### Library data of the parts
C2 C7 C8 = C: as C5 on sheet CM5_GPIO; Value: 10u; Footprint: Capacitor_SMD:C_0805_2012Metric
C3 = C_Polarized: Part Description: Capacitor, SP-Cap, 100u, 6.3V, 15mR ESR; Field4: Mouser; Field5: 667-EEF-CX0J101R; Field7: Panasonic; Value: 100uF; Footprint: Capacitor_Tantalum_SMD:CP_EIA-7343-31_Kemet-D
C12 C13 = C: as C9 on sheet CM5IO; Value: 100n; Footprint: Capacitor_SMD:C_0402_1005Metric
J5 J16 = Conn_01x22_Socket: Part Description: 22 Position FFC, FPC Connector Contacts, Bottom 0.020" (0.50mm) Surface Mount, Right Angle; Field4: Mouser; Field5: 798-FH12-22S-0.5SH55; Field6: FH12-22S-0.5SH55; Field7: Hirose; Value: Conn_01x22_Female; Footprint: CM5IO:Hirose_FH12-22S-0.5SH_1x22-1MP_P0.50mm_Horizontal
J6 = Conn_02x02_Odd_Even: as J9 on sheet CM5_GPIO; Field5: THD-02-R; Part Description: PinHeader_2x02_P2.54mm_Vertical; Value: THD-02-R; Footprint: Connector_PinHeader_2.54mm:PinHeader_2x02_P2.54mm_Vertical
J10 J22 = HDMI_A_1.4: Part Description: HDMI Connector, Right Angle, 19 Contacts, Receptacle, Surface Mount, Surface Mount Right Angle; Field4: Farnell; Field5: 2614936; Field7: EDAC; Field8: UCON00802; Field6: 690-019-298-412; Value: 690-019-298-412; Footprint: CM5IO:EDAC 690-019-298-412
J12 = USB3_A: Part Description: Dual USB 3 connector; Field6: UBAF30-D2011; Field7: Mtconn; Field5: UBAF30-D2011; Value: USB3_A; Footprint: CM5IO:MTCONN_UBAF30-D2011
Module1 = ComputeModule5-CM5: as Module1 on sheet CM5_GPIO; Field6: 2x 10164227-1001A1RLF; Value: ComputeModule5-CM5; Footprint: CM5IO:Raspberry-Pi-5-Compute-Module
R6-R8 = R: as R9 on sheet CM5IO; Value: 2.2K 1%; Footprint: Resistor_SMD:R_0402_1005Metric
R12 = R: Part Description: Resistor 15K M1005 1% 63mW; Field4: Farnell; Field5: 9239375; Field6: MCR01MZPF1502; Field7: Rohm; Field8: 120891581; Value: 15K 1%; Footprint: Resistor_SMD:R_0402_1005Metric
U6 = AP2553W6: Part Description: Power Switch/Driver 1:1 P-Channel 2.1A SOT-23-6; Field4: Digikey; Field5: 31-AP22653W6-7CT-ND; Field7: Diodes; Field6: AP22653W6; Value: AP22653W6; Footprint: Package_TO_SOT_SMD:SOT-23-6
U12 = RT9742SNGV: Part Description: Power Switch/Driver 1:1 N-Channel 500mA SOT-23-3; Field4: Farnell; Field5: 2575555; Field7: RichTek; Field8: USWI00155; Field6: RT9742SNGV; Value: RT9742SNGV; Footprint: Package_TO_SOT_SMD:TSOT-23_HandSoldering

## Sheet PCIe-M2.SchDoc
size 297 x 209 mm
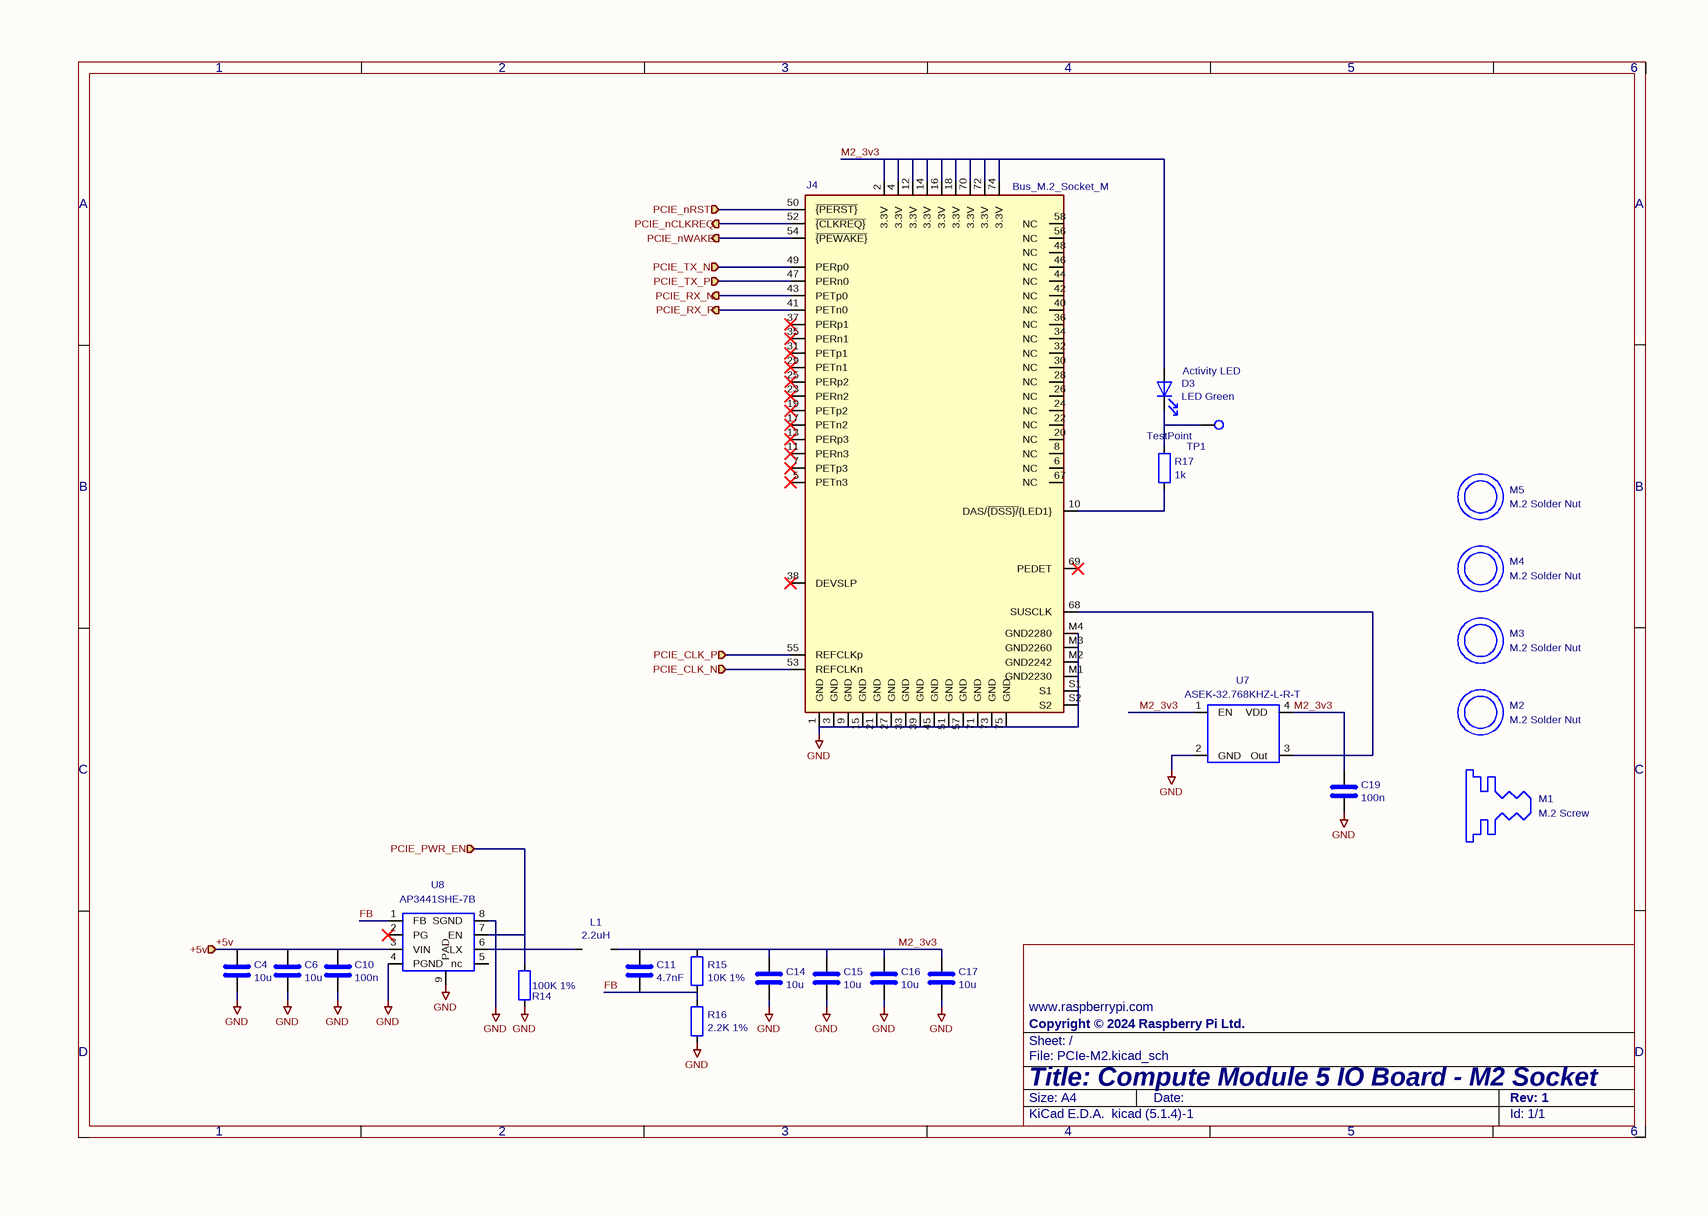
[diagram p4: PCIe-M2.SchDoc]

### Parts
C4  10u  [C_0805_2012Metric]
C6  10u  [C_0805_2012Metric]
C10  100n  [C_0402_1005Metric]
C11  4.7nF  [C_0402_1005Metric]
C14  10u  [C_0805_2012Metric]
C15  10u  [C_0805_2012Metric]
C16  10u  [C_0805_2012Metric]
C17  10u  [C_0805_2012Metric]
C19  100n  [C_0402_1005Metric]
D3  LED Green  [LED_0603_1608Metric]
J4  Bus_M.2_Socket_M  [M.2 M Key socket]
L1  2.2uH  [L_Bourns_SRP5030CC]
M1  M.2 Screw
M2  M.2 Solder Nut
M3  M.2 Solder Nut
M4  M.2 Solder Nut
M5  M.2 Solder Nut
R14  100K 1%  [R_0402_1005Metric]
R15  10K 1%  [R_0402_1005Metric]
R16  2.2K 1%  [R_0402_1005Metric]
R17  1k  [R_0402_1005Metric]
TP1  TestPoint  [TestPoint_Pad_2.0x2.0mm]
U7  ASEK-32.768KHZ-L-R-T  [Crystal_SMD_3225-4Pin_3.2x2.5mm]
U8  AP3441SHE-7B  [DFN-8-1EP_2x2mm_P0.5mm_EP1.05x1.75mm]

### Ports
+5v (in), PCIE_CLK_N (in), PCIE_CLK_P (in), PCIE_nCLKREQ (out), PCIE_nRST (in), PCIE_nWAKE (out), PCIE_PWR_EN (in), PCIE_RX_N (out), PCIE_RX_P (out), PCIE_TX_N (in), PCIE_TX_P (in)

### Nets
GND: C4.2 C6.2 C10.2 C14.2 C15.2 C16.2 C17.2 C19.2 J4.1(GND) J4.3(GND) J4.9(GND) J4.15(GND) J4.21(GND) J4.27(GND) J4.33(GND) J4.39(GND) J4.45(GND) J4.51(GND) J4.57(GND) J4.71(GND) J4.73(GND) J4.75(GND) J4.M1(GND2230) J4.M2(GND2242) J4.M3(GND2260) J4.M4(GND2280) J4.S1 J4.S2 R14.2 R16.2 U7.2(GND) U8.4(PGND) U8.8(SGND) U8.9(PAD)  [project net DPHY1_C_N]
+5v: C4.1 C6.1 C10.1 U8.3(VIN) ; port +5v
FB: C11.2 R15.2 R16.1 U8.1(FB)
M2_3v3: C11.1 C14.1 C15.1 C16.1 C17.1 C19.1 D3.2(A) J4.2(3.3V) J4.4(3.3V) J4.12(3.3V) J4.14(3.3V) J4.16(3.3V) J4.18(3.3V) J4.70(3.3V) J4.72(3.3V) J4.74(3.3V) L1.2 R15.1 U7.1(EN) U7.4(VDD)
PCIE_CLK_N: J4.53(REFCLKn) ; port PCIE_CLK_N
PCIE_CLK_P: J4.55(REFCLKp) ; port PCIE_CLK_P
PCIE_nCLKREQ: J4.52(~{{CLKREQ}}) ; port PCIE_nCLKREQ
PCIE_nRST: J4.50(~{{PERST}}) ; port PCIE_nRST
PCIE_nWAKE: J4.54(~{{PEWAKE}}) ; port PCIE_nWAKE
PCIE_PWR_EN: R14.1 U8.7(EN) ; port PCIE_PWR_EN
PCIE_RX_N: J4.43(PETp0) ; port PCIE_RX_N
PCIE_RX_P: J4.41(PETn0) ; port PCIE_RX_P
PCIE_TX_N: J4.49(PERp0) ; port PCIE_TX_N
PCIE_TX_P: J4.47(PERn0) ; port PCIE_TX_P
NetD3_1: D3.1(K) R17.1 TP1.1
NetJ4_10: J4.10(DAS/~{{DSS}/}{LED1}) R17.2
NetJ4_68: J4.68(SUSCLK) U7.3(Out)
NetL1_1: L1.1 U8.6(LX)

Not connected (* = marked no-connect by the designer): J4 5(PETn3)* 6(NC) 7(PETp3)* 8(NC) 11(PERn3)* 13(PERp3)* 17(PETn2)* 19(PETp2)* 20(NC) 22(NC) 23(PERn2)* 24(NC) 25(PERp2)* 26(NC) 28(NC) 29(PETn1)* 30(NC) 31(PETp1)* 32(NC) 34(NC) 35(PERn1)* 36(NC) 37(PERp1)* 38(DEVSLP)* 40(NC) 42(NC) 44(NC) 46(NC) 48(NC) 56(NC) 58(NC) 67(NC) 69(PEDET)*; U8 2(PG)* 5(nc)

### Notes on the sheet
- (near D3) Activity LED
- 1
- 2
- 3
- 4
- 5
- 6
- A
- B
- C
- www.raspberrypi.com <http://www.raspberrypi.com>
- D
- Title: Compute Module 5 IO Board - M2 Socket
- File: PCIe-M2.kicad_sch
- Sheet: /
- Copyright © 2024 Raspberry Pi Ltd.
- KiCad E.D.A.  kicad (5.1.4)-1
- Size: A4
- Date:
- Rev: 1
- Id: 1/1

### Library data of the parts
C4 C6 C14-C17 = C: Part Description: 10uF 10% 10V Ceramic Capacitor X7R 0805 (2012 Metric); Field4: Digikey; Field5: 490-14381-1-ND; Field6: GRM21BR71A106KA73L; Field7: Murata; Field8: 111893011; Value: 10u; Footprint: Capacitor_SMD:C_0805_2012Metric
C10 C19 = C: as C9 on sheet CM5IO; Value: 100n; Footprint: Capacitor_SMD:C_0402_1005Metric
C11 = C: Part Description: 4.7nF capacitor 0402; Value: 4.7nF; Footprint: Capacitor_SMD:C_0402_1005Metric
D3 = LED: as D2 on sheet CM5_GPIO; Value: LED Green; Footprint: LED_SMD:LED_0603_1608Metric
J4 = Bus_M.2_Socket_M: Part Description: M.2 M Key connector; Description: M.2 Socket 3 Mechanical Key M; Field5: MTSSD03-67MSW337; Field7: MTCONN; Field6: MTSSD03-67MSW337; Value: Bus_M.2_Socket_M; Footprint: CM5IO:M.2 M Key socket
L1 = L: Part Description: Inductor, SMT, 2520, 2u2, IRMS=7A, ISAT=8A, DCR=0.032R; Field6: SRP5030CC-2R2M; Field7: Bourns; Field5: SRP5030CC-2R2M; Value: 2.2uH; Footprint: CM5IO:L_Bourns_SRP5030CC
M1 = M.2_Screw: Part Description: M.2 Screw; Value: M.2 Screw
M2-M5 = SolderNut: Part Description: Solder nut for M.2 slot; Value: M.2 Solder Nut
R14 = R: Part Description: Resistor 100K M1005 1% 63mW; Field4: Farnell; Field6: MCR01MZPF1003; Field7: Rohm; Value: 100K 1%; Footprint: Resistor_SMD:R_0402_1005Metric
R15 = R: Part Description: Resistor 10K M1005 1% 63mW; Field4: Farnell; Field7: Rohm; Field6: MCR01MZPF1002; Value: 10K 1%; Footprint: Resistor_SMD:R_0402_1005Metric
R16 = R: as R9 on sheet CM5IO; Value: 2.2K 1%; Footprint: Resistor_SMD:R_0402_1005Metric
R17 = R: as R1 on sheet CM5_GPIO; Value: 1k; Footprint: Resistor_SMD:R_0402_1005Metric
TP1 = TestPoint: Field4: nf; Field5: nf; Field6: nf; Field7: nf; Part Description: Test point; Value: TestPoint; Footprint: TestPoint:TestPoint_Pad_2.0x2.0mm
U7 = ASEK-32.768KHZ-L-R-T: Part Description: 32KHz Xtal oscilator; Field7: abracon; Field5: ASEK-32.768KHZ-L-R-T; Field6: ASEK-32.768KHZ-L-R-T; Value: ASEK-32.768KHZ-L-R-T; Footprint: Crystal:Crystal_SMD_3225-4Pin_3.2x2.5mm
U8 = AP3441SHE-7B: Part Description: 3A DC-DC converter; Field7: Diodes; Field5: AP3441SHE-7B; Field6: AP3441SHE-7B; Value: AP3441SHE-7B; Footprint: Package_DFN_QFN:DFN-8-1EP_2x2mm_P0.5mm_EP1.05x1.75mm

## Sheet PSUs.SchDoc
size 297 x 209 mm
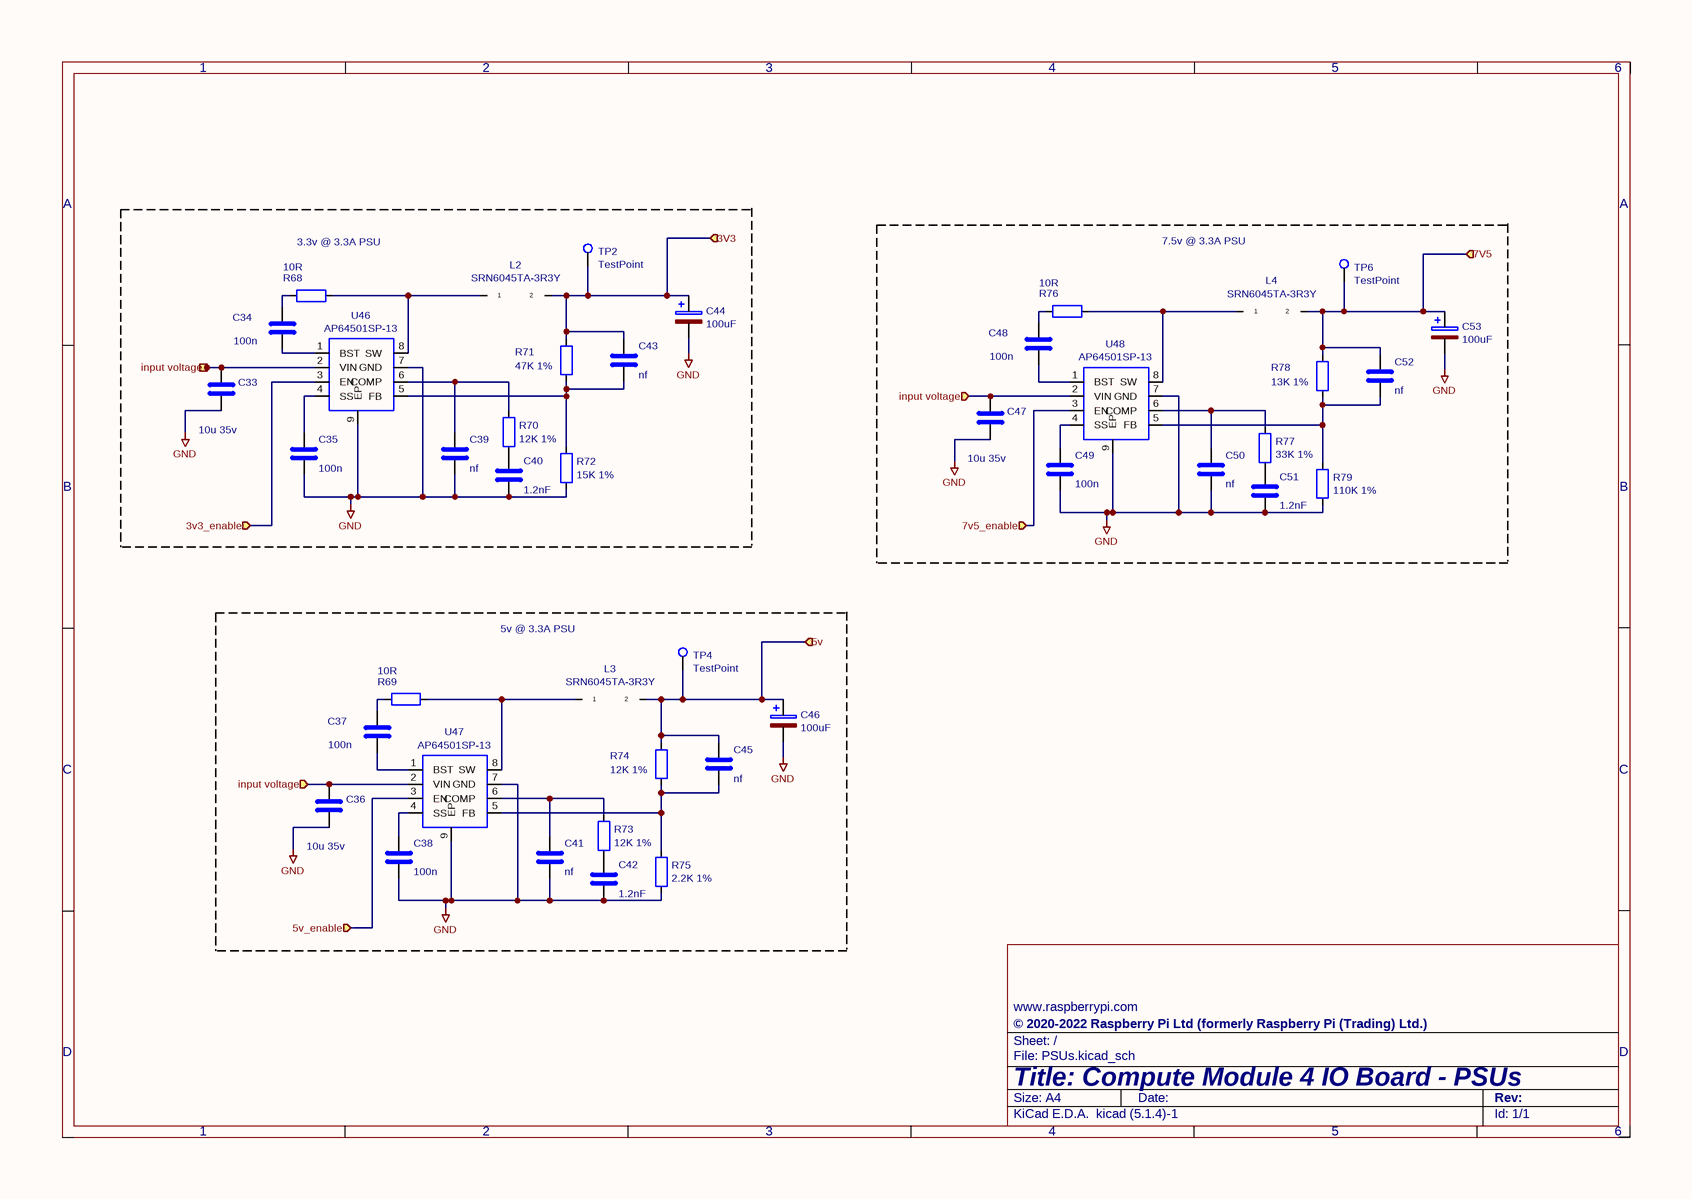
[diagram p5: PSUs.SchDoc]

### Parts
C33  10u 35v  [C_0805_2012Metric]
C34  100n  [C_0805_2012Metric]
C35  100n  [C_0805_2012Metric]
C36  10u 35v  [C_0805_2012Metric]
C37  100n  [C_0805_2012Metric]
C38  100n  [C_0805_2012Metric]
C39  nf  [C_0805_2012Metric]
C40  1.2nF  [C_0805_2012Metric]
C41  nf  [C_0805_2012Metric]
C42  1.2nF  [C_0805_2012Metric]
C43  nf  [C_0805_2012Metric]
C44  100uF  [CP_EIA-7343-31_Kemet-D]
C45  nf  [C_0805_2012Metric]
C46  100uF  [CP_EIA-7343-31_Kemet-D]
C47  10u 35v  [C_0805_2012Metric]
C48  100n  [C_0805_2012Metric]
C49  100n  [C_0805_2012Metric]
C50  nf  [C_0805_2012Metric]
C51  1.2nF  [C_0805_2012Metric]
C52  nf  [C_0805_2012Metric]
C53  100uF  [CP_EIA-7343-31_Kemet-D]
L2  SRN6045TA-3R3Y  [L_Bourns_SRN6045TA]
L3  SRN6045TA-3R3Y  [L_Bourns_SRN6045TA]
L4  SRN6045TA-3R3Y  [L_Bourns_SRN6045TA]
R68  10R  [R_0805_2012Metric_Pad1.20x1.40mm_HandSolder]
R69  10R  [R_0805_2012Metric_Pad1.20x1.40mm_HandSolder]
R70  12K 1%  [R_0805_2012Metric_Pad1.20x1.40mm_HandSolder]
R71  47K 1%  [R_0805_2012Metric_Pad1.20x1.40mm_HandSolder]
R72  15K 1%  [R_0805_2012Metric_Pad1.20x1.40mm_HandSolder]
R73  12K 1%  [R_0805_2012Metric_Pad1.20x1.40mm_HandSolder]
R74  12K 1%  [R_0805_2012Metric_Pad1.20x1.40mm_HandSolder]
R75  2.2K 1%  [R_0805_2012Metric_Pad1.20x1.40mm_HandSolder]
R76  10R  [R_0805_2012Metric_Pad1.20x1.40mm_HandSolder]
R77  33K 1%  [R_0805_2012Metric_Pad1.20x1.40mm_HandSolder]
R78  13K 1%  [R_0805_2012Metric_Pad1.20x1.40mm_HandSolder]
R79  110K 1%  [R_0805_2012Metric_Pad1.20x1.40mm_HandSolder]
TP2  TestPoint  [TestPoint_Pad_1.0x1.0mm]
TP4  TestPoint  [TestPoint_Pad_1.0x1.0mm]
TP6  TestPoint  [TestPoint_Pad_1.0x1.0mm]
U46  AP64501SP-13  [SOIC-8-1EP_3.9x4.9mm_P1.27mm_EP2.95x4.9mm_Mask2.71x3.4mm_ThermalVias]
U47  AP64501SP-13  [SOIC-8-1EP_3.9x4.9mm_P1.27mm_EP2.95x4.9mm_Mask2.71x3.4mm_ThermalVias]
U48  AP64501SP-13  [SOIC-8-1EP_3.9x4.9mm_P1.27mm_EP2.95x4.9mm_Mask2.71x3.4mm_ThermalVias]

### Ports
3V3 (in), 3v3_enable (in), 5v (in), 5v_enable (in), 7V5 (in), 7v5_enable (in), input voltage (in)

### Nets
GND: C33.2 C35.2 C36.2 C38.2 C39.2 C40.2 C41.2 C42.2 C44.2 C46.2 C47.2 C49.2 C50.2 C51.2 C53.2 R72.2 R75.2 R79.2 U46.7(GND) U46.9(EP) U47.7(GND) U47.9(EP) U48.7(GND) U48.9(EP)  [project net DPHY1_C_N]
3V3: C43.1 C44.1 L2.2 R71.1 TP2.1 ; port 3V3
3v3_enable: U46.3(EN) ; port 3v3_enable
5v: C45.1 C46.1 L3.2 R74.1 TP4.1 ; port 5v
5v_enable: U47.3(EN) ; port 5v_enable
7V5: C52.1 C53.1 L4.2 R78.1 TP6.1 ; port 7V5
7v5_enable: U48.3(EN) ; port 7v5_enable
input voltage: C33.1 C36.1 C47.1 U46.2(VIN) U47.2(VIN) U48.2(VIN) ; port input voltage
NetC34_1: C34.1 R68.2
NetC34_2: C34.2 U46.1(BST)
NetC35_1: C35.1 U46.4(SS)
NetC37_1: C37.1 R69.2
NetC37_2: C37.2 U47.1(BST)
NetC38_1: C38.1 U47.4(SS)
NetC39_1: C39.1 R70.1 U46.6(COMP)
NetC40_1: C40.1 R70.2
NetC41_1: C41.1 R73.1 U47.6(COMP)
NetC42_1: C42.1 R73.2
NetC43_2: C43.2 R71.2 R72.1 U46.5(FB)
NetC45_2: C45.2 R74.2 R75.1 U47.5(FB)
NetC48_1: C48.1 R76.2
NetC48_2: C48.2 U48.1(BST)
NetC49_1: C49.1 U48.4(SS)
NetC50_1: C50.1 R77.1 U48.6(COMP)
NetC51_1: C51.1 R77.2
NetC52_2: C52.2 R78.2 R79.1 U48.5(FB)
NetL2_1: L2.1 R68.1 U46.8(SW)
NetL3_1: L3.1 R69.1 U47.8(SW)
NetL4_1: L4.1 R76.1 U48.8(SW)

### Notes on the sheet
- (near R68) 3.3v @ 3.3A PSU
- 7.5v @ 3.3A PSU
- 5v @ 3.3A PSU
- 1
- 2
- 3
- 4
- 5
- 6
- A
- B
- C
- www.raspberrypi.com <http://www.raspberrypi.com>
- D
- Title: Compute Module 4 IO Board - PSUs
- File: PSUs.kicad_sch
- Sheet: /
- © 2020-2022 Raspberry Pi Ltd (formerly Raspberry Pi (Trading) Ltd.)
- KiCad E.D.A.  kicad (5.1.4)-1
- Size: A4
- Date:
- Rev:
- Id: 1/1

### Library data of the parts
C33 C36 C47 = C: Part Description: 10uF 10% or 20% 35V Ceramic Capacitor X6S 0805 (2012 Metric); Field5: 490-10505-1-ND; Field4: Digikey; Field6: GRM21BC8YA106KE11L; Field7: Murata; Value: 10u 35v; Footprint: Capacitor_SMD:C_0805_2012Metric
C34 C35 C37 C38 C48 C49 = C: as C9 on sheet CM5IO; Value: 100n; Footprint: Capacitor_SMD:C_0805_2012Metric
C39 C41 C50 = C: Value: nf; Footprint: Capacitor_SMD:C_0805_2012Metric
C40 C42 C51 = C: Part Description: 1200pF 10% 10V Ceramic Capacitor X5R 0402 (1005 Metric); Field4: Digikey; Field5: 490-16429-1-ND; Field6: GCM155R71H122KA37D; Field7: Murata; Value: 1.2nF; Footprint: Capacitor_SMD:C_0805_2012Metric
C43 C45 C52 = C: Part Description: 27pF 5% 50V Ceramic Capacitor C0G, NP0 0402 (1005 Metric); Field4: Digikey; Field5: 490-17672-2-ND; Field6: GJM1555C1H270JB01D; Field7: Murata; Value: nf; Footprint: Capacitor_SMD:C_0805_2012Metric
C44 C46 C53 = CP: Part Description: Capacitor, SP-Cap, 100u, 6.3V, 15mR ESR; Field4: Mouser; Field5: 667-EEF-CX0J101R; Value: 100uF; Footprint: Capacitor_Tantalum_SMD:CP_EIA-7343-31_Kemet-D
L2-L4 = INDUCTOR: Part Description: 3.3µH Semi-Shielded Wirewound Inductor 7.8A 21mOhm Nonstandard; Field4: Farnell; Field5: 2616889; Field7: Bourns; Field6: SRN6045TA-3R3Y; Value: SRN6045TA-3R3Y; Footprint: Inductor_SMD:L_Bourns_SRN6045TA
R68 R69 R76 = R: Part Description: Resistor 10R M1005 1% 63mW; Field4: Farnell; Field5: 9238999; Field7: Yageo; Field6: RC0402FR-0710RL; Field8: URES00256; Value: 10R; Footprint: Resistor_SMD:R_0805_2012Metric_Pad1.20x1.40mm_HandSolder
R70 R73 R77 = R: Part Description: Resistor 12K M1005 1% 63mW; Field4: Farnell; Field5: 9239367; Field7: Rohm; Field6: MCR01MZPF1202; Footprint: Resistor_SMD:R_0805_2012Metric_Pad1.20x1.40mm_HandSolder
  R70 R73: Value: 12K 1%
  R77: Value: 33K 1%
R71 R74 R78 = R: Part Description: Resistor 47K M1005 1% 63mW; Field4: Farnell; Field5: 9239430; Field7: KOA EUROPE GMBH; Field6: RK73G1ETQTP4702D; Field8: 120892781; Footprint: Resistor_SMD:R_0805_2012Metric_Pad1.20x1.40mm_HandSolder
  R71: Value: 47K 1%
  R74: Value: 12K 1%
  R78: Value: 13K 1%
R72 R75 R79 = R: as R12 on sheet CM5_HighSpeed; Footprint: Resistor_SMD:R_0805_2012Metric_Pad1.20x1.40mm_HandSolder
  R72: Value: 15K 1%
  R75: Value: 2.2K 1%
  R79: Value: 110K 1%
TP2 TP4 TP6 = TestPoint: Field4: nf; Field5: nf; Field6: nf; Field7: nf; Value: TestPoint; Footprint: TestPoint:TestPoint_Pad_1.0x1.0mm
U46-U48 = AP64351: Part Description: Buck Switching Regulator IC Positive Adjustable 0.8V 1 Output 5A 8-SOIC (0.154", 3.90mm Width) Exposed Pad; Field4: Digikey; Field5: 31-AP64501SP-13CT-ND; Field7: Diodes; Field6: AP64501SP-13; Value: AP64501SP-13; Footprint: Package_SO:SOIC-8-1EP_3.9x4.9mm_P1.27mm_EP2.95x4.9mm_Mask2.71x3.4mm_ThermalVias

## Sheet YD-ESP32-S3.SchDoc
size 420 x 297 mm
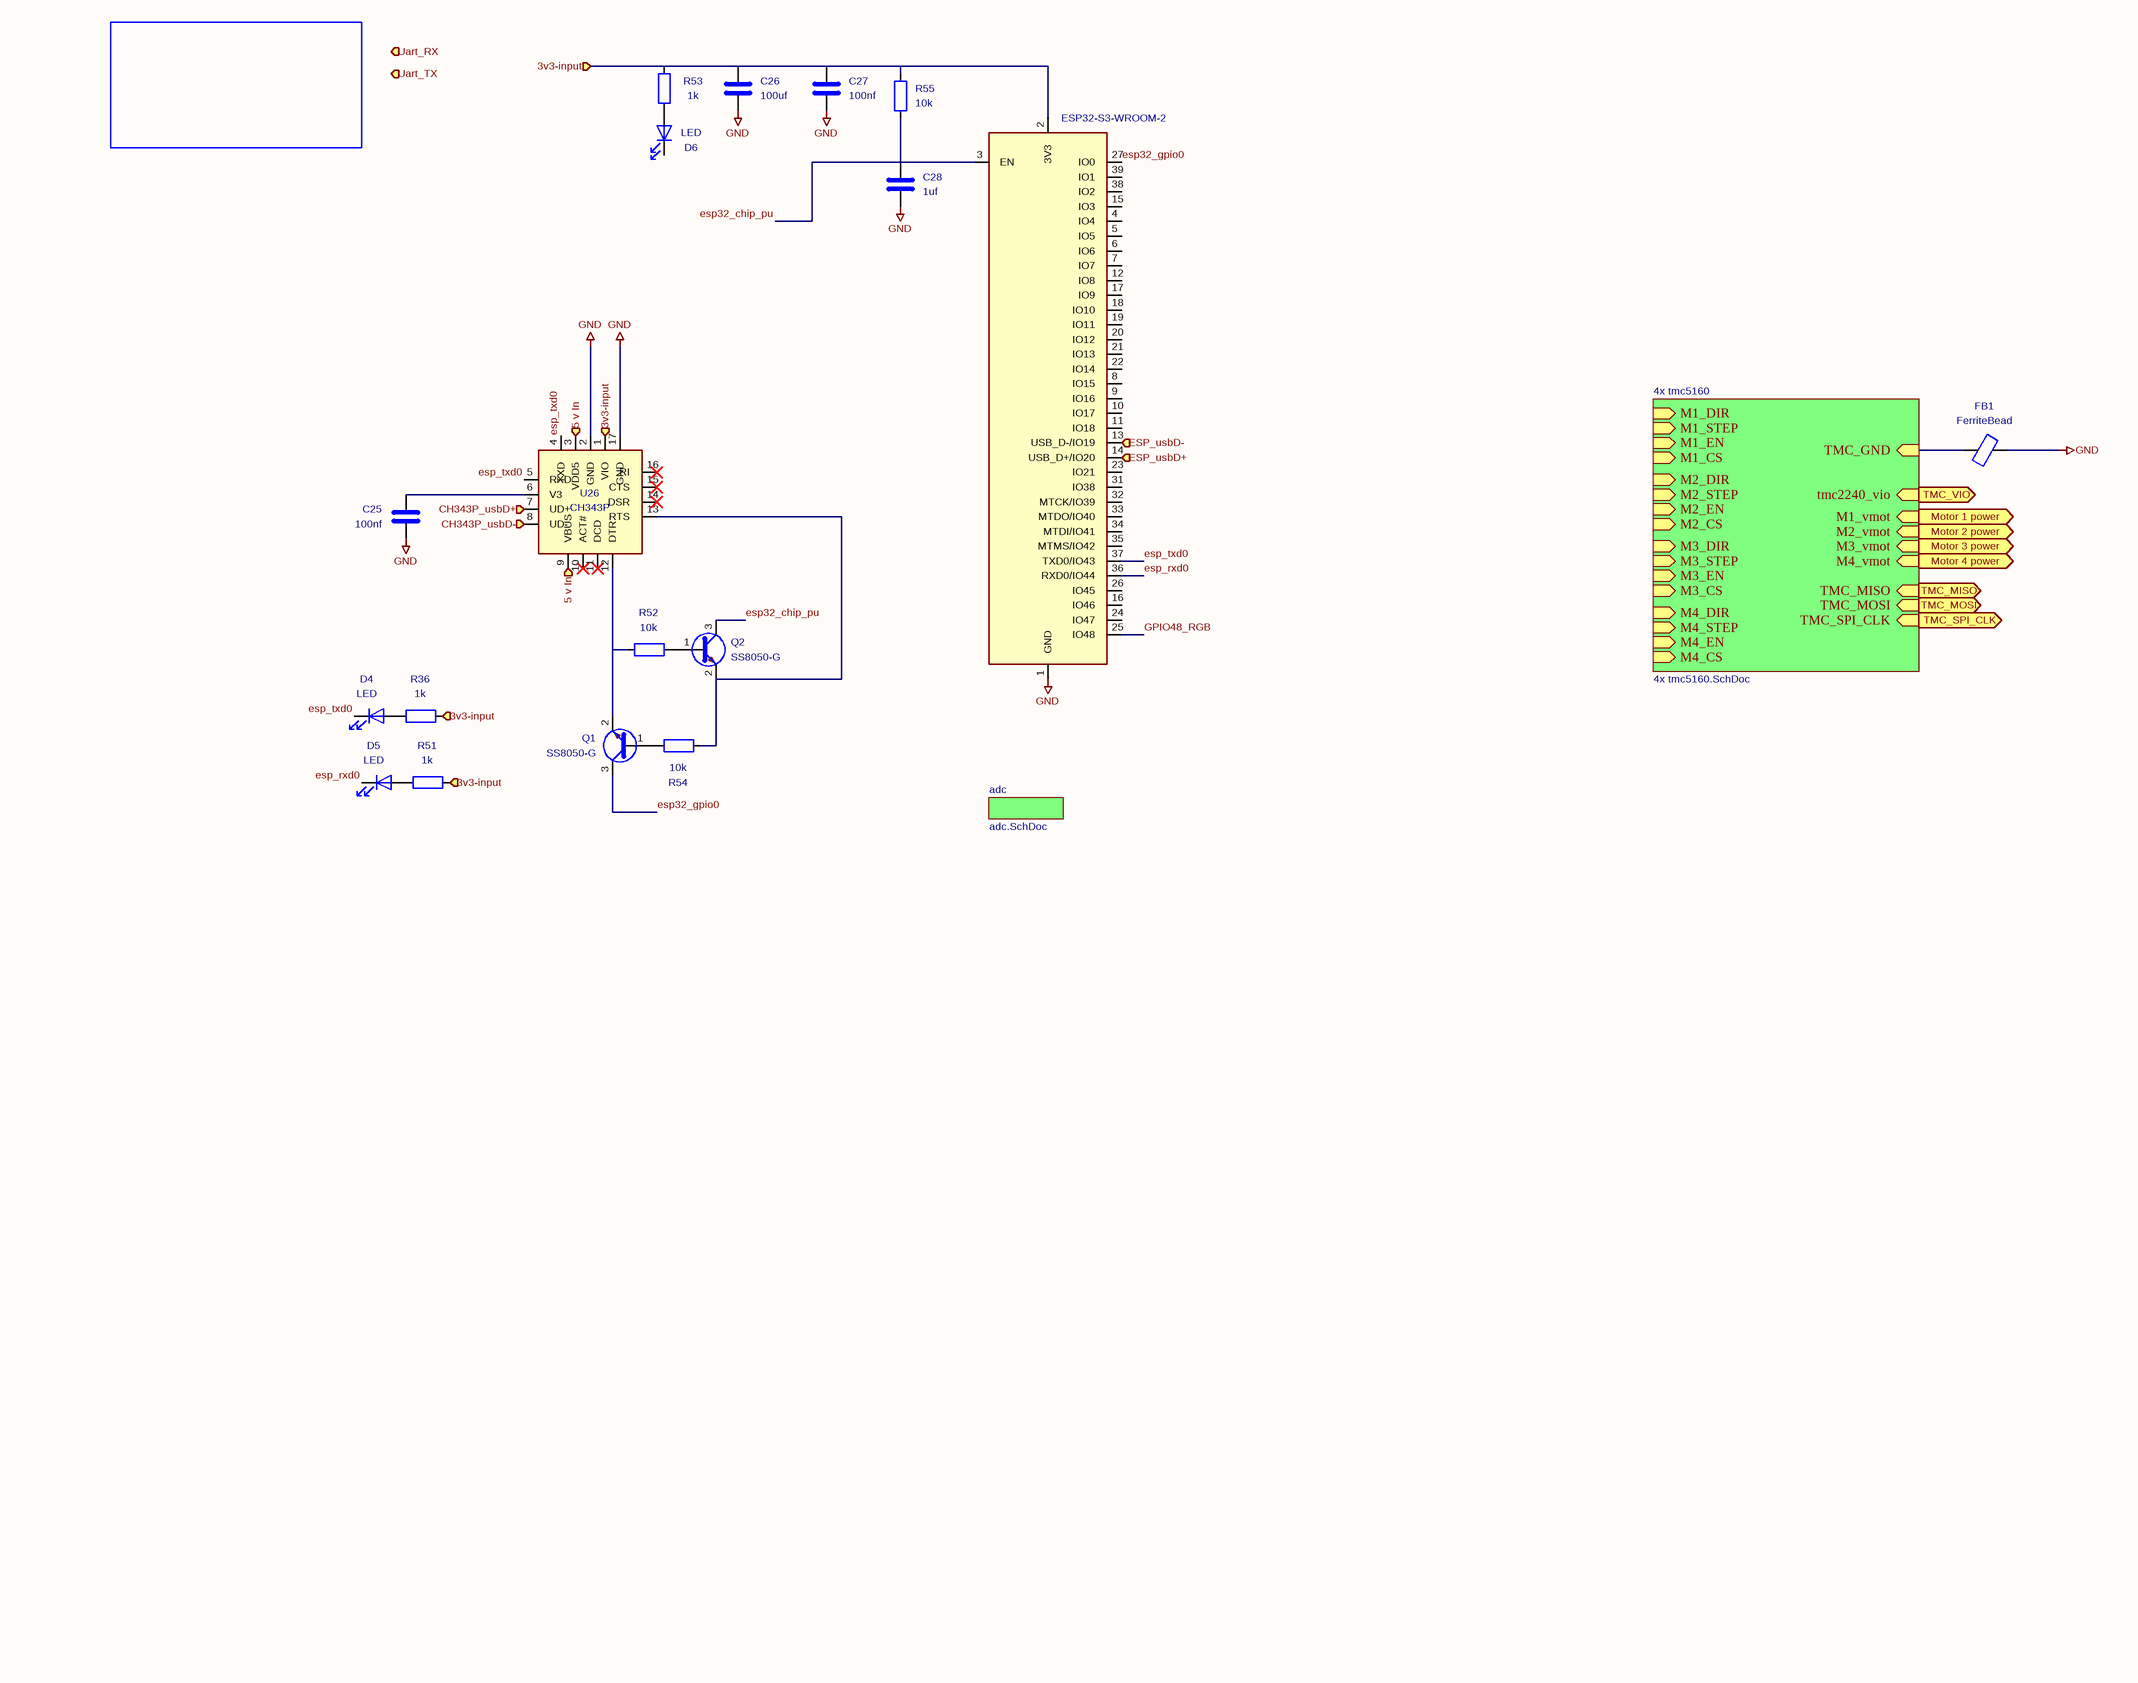
[diagram p6: YD-ESP32-S3.SchDoc]

### Parts
C25  100nf  [C_0805_2012Metric]
C26  100uf  [C_0805_2012Metric]
C27  100nf  [C_0805_2012Metric]
C28  1uf  [C_0805_2012Metric]
D4  LED  [LED_Lumex_SML-LX0303SIUPGUSB]
D5  LED  [LED_Lumex_SML-LX0303SIUPGUSB]
D6  LED  [LED_Lumex_SML-LX0303SIUPGUSB]
FB1  FerriteBead
Q1  SS8050-G  [TO-18-3_Lens]
Q2  SS8050-G  [TO-18-3_Lens]
R36  1k  [R_0805_2012Metric_Pad1.20x1.40mm_HandSolder]
R51  1k  [R_0805_2012Metric_Pad1.20x1.40mm_HandSolder]
R52  10k  [R_0805_2012Metric_Pad1.20x1.40mm_HandSolder]
R53  1k  [R_0805_2012Metric_Pad1.20x1.40mm_HandSolder]
R54  10k  [R_0805_2012Metric_Pad1.20x1.40mm_HandSolder]
R55  10k  [R_0805_2012Metric_Pad1.20x1.40mm_HandSolder]
U26  CH343P  [QFN-16-1EP_3x3mm_P0.5mm_EP1.7x1.7mm_ThermalVias]
U27  ESP32-S3-WROOM-2  [ESP32-S3-WROOM-2]

### Sub-sheets
4x tmc5160 = 4x tmc5160.SchDoc: M3_vmot (in), TMC_MISO (in), TMC_SPI_CLK (in), TMC_MOSI (in), M1_EN (in), M1_DIR (in), M1_STEP (in), M1_CS (in), tmc2240_vio (in), M2_STEP (in), M2_DIR (in), M2_vmot (in), M2_EN (in), M2_CS (in), M1_vmot (in), M3_EN (in), M3_CS (in), M3_STEP (in), M3_DIR (in), M4_vmot (in), M4_EN (in), M4_CS (in), M4_STEP (in), M4_DIR (in), TMC_GND (in)
adc = adc.SchDoc: no entries

### Ports
3v3-input (in), 5 v In (in), CH343P_usbD+ (in), CH343P_usbD- (in), ESP_usbD+ (in), ESP_usbD- (in), Motor 1 power (in), Motor 2 power (in), Motor 3 power (in), Motor 4 power (in), TMC_MISO (in), TMC_MOSI (in), TMC_SPI_CLK (in), TMC_VIO (in), Uart_RX (in), Uart_TX (in)

### Nets
GND: C25.2 C26.2 C27.2 C28.2 FB1.2 U26.2(GND) U26.17(GND) U27.1(GND)  [project net DPHY1_C_N]
3v3-input: C26.1 C27.1 R36.2 R51.2 R53.2 R55.2 U26.1(VIO) U27.2(3V3) ; port 3v3-input
5 v In: U26.3(VDD5) U26.9(VBUS) ; port 5 v In
CH343P_usbD+: U26.7(UD+) ; port CH343P_usbD+
CH343P_usbD-: U26.8(UD-) ; port CH343P_usbD-
esp32_chip_pu: C28.1 Q2.3(C) R55.1 U27.3(EN)
esp32_gpio0: Q1.3(C) U27.27(IO0)
esp_rxd0: D5.1(K) U27.36(RXD0/IO44)
esp_txd0: D4.1(K) U26.4(TXD) U26.5(RXD) U27.37(TXD0/IO43)
ESP_usbD+: U27.14(USB_D+/IO20) ; port ESP_usbD+
ESP_usbD-: U27.13(USB_D-/IO19) ; port ESP_usbD-
GPIO48_RGB: U27.25(IO48)
M1_vmot: port Motor 1 power, sheet 4x tmc5160/M1_vmot
M2_vmot: port Motor 2 power, sheet 4x tmc5160/M2_vmot
M3_vmot: port Motor 3 power, sheet 4x tmc5160/M3_vmot
M4_vmot: port Motor 4 power, sheet 4x tmc5160/M4_vmot
tmc2240_vio: port TMC_VIO, sheet 4x tmc5160/tmc2240_vio
TMC_GND: FB1.1 ; sheet 4x tmc5160/TMC_GND
TMC_MISO: port TMC_MISO, sheet 4x tmc5160/TMC_MISO
TMC_MOSI: port TMC_MOSI, sheet 4x tmc5160/TMC_MOSI
TMC_SPI_CLK: port TMC_SPI_CLK, sheet 4x tmc5160/TMC_SPI_CLK
NetC25_1: C25.1 U26.6(V3)
NetD4_2: D4.2(A) R36.1
NetD5_2: D5.2(A) R51.1
NetD6_2: D6.2(A) R53.1
NetQ1_1: Q1.1(B) R54.1
NetQ1_2: Q1.2(E) R52.1 U26.12(DTR)
NetQ2_1: Q2.1(B) R52.2
NetQ2_2: Q2.2(E) R54.2 U26.13(RTS)

Not connected (* = marked no-connect by the designer): D6 1(K); U26 10(ACT#)* 11(DCD)* 14(DSR)* 15(CTS)* 16(RI)*; U27 4(IO4) 5(IO5) 6(IO6) 7(IO7) 8(IO15) 9(IO16) 10(IO17) 11(IO18) 12(IO8) 15(IO3) 16(IO46) 17(IO9) 18(IO10) 19(IO11) 20(IO12) 21(IO13) 22(IO14) 23(IO21) 24(IO47) 26(IO45) 28(NC) 29(NC) 30(NC) 31(IO38) 32(MTCK/IO39) 33(MTDO/IO40) 34(MTDI/IO41) 35(MTMS/IO42) 38(IO2) 39(IO1) 40(GND) 41(GND)

### Notes on the sheet
- 1
- 2
- 3
- 4
- 5
- 6
- 7
- 8
- A
- B
- C
- D
- E
- Title:
- File: YD-ESP32-S3.kicad_sch
- Sheet: /
- F
- KiCad E.D.A.  kicad (5.1.4)-1
- Size: A3
- Date:
- Rev:
- Id: 1/1

### Library data of the parts
C25-C28 = C: Description: Unpolarized capacitor; Footprint: Capacitor_SMD:C_0805_2012Metric
  C25 C27: Value: 100nf
  C26: Value: 100uf
  C28: Value: 1uf
D4-D6 = LED: Description: Light emitting diode; Value: LED; Footprint: LED_SMD:LED_Lumex_SML-LX0303SIUPGUSB
Q1 Q2 = BC817: Description: 0.8A Ic, 45V Vce, NPN Transistor, SOT-23; Value: SS8050-G; Footprint: Package_TO_SOT_THT:TO-18-3_Lens
R36 R51-R55 = R: Description: Resistor; Footprint: Resistor_SMD:R_0805_2012Metric_Pad1.20x1.40mm_HandSolder
  R36 R51 R53: Value: 1k
  R52 R54 R55: Value: 10k
U27 = ESP32-S3-WROOM-2: Description: RF Module, 2.4 GHz, Wi­-Fi, Bluetooth, BLE, ESP32­-S3R8V; Value: ESP32-S3-WROOM-2; Footprint: RF_Module:ESP32-S3-WROOM-2
FB1 = FerriteBead: Description: Ferrite bead; Value: FerriteBead
U26 = CH343P: Value: CH343P; Footprint: Package_DFN_QFN:QFN-16-1EP_3x3mm_P0.5mm_EP1.7x1.7mm_ThermalVias